# EAGLE design VlasceanuVladProiect2026 (EAGLE 9.7.0)
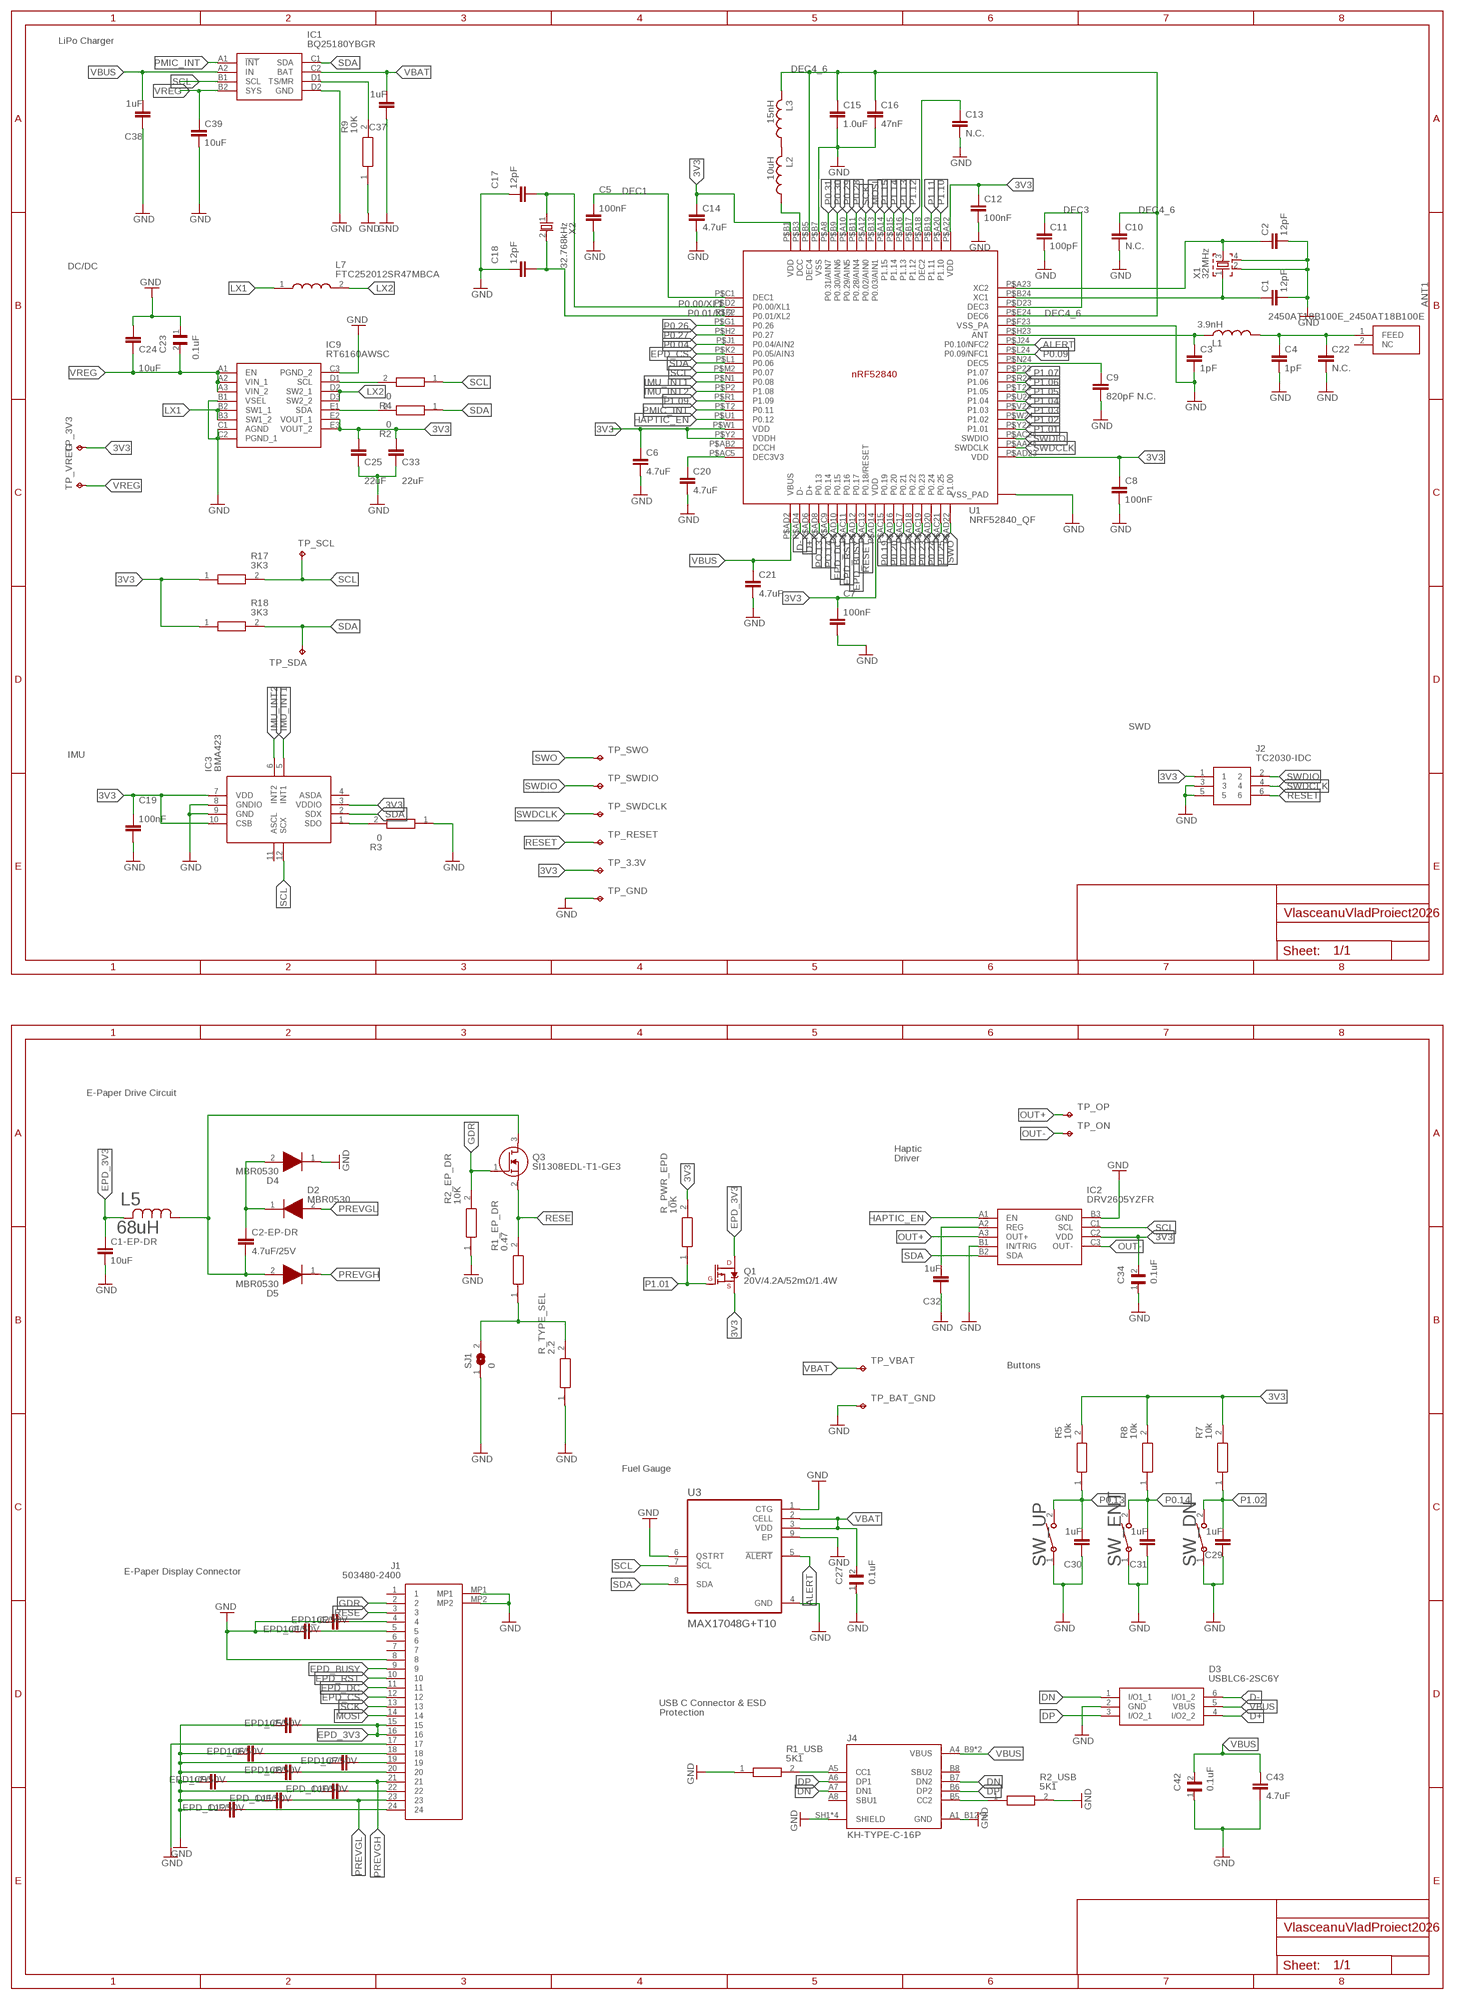
[diagram p0: schematic, sheet 1]

## Parts
ANT1  2450AT18B100E_2450AT18B100E  [2450AT18B100E_ANTC3216X140N]
C1  12pF  NORDIC_NRF_3_CAPACITOR_0201_L  [NORDIC_NRF_3_RESC0201_L]
C1-EP-DR  10uF  PERFECT_0402_CAP_0402  [PERFECT_0402_0402]
C2  12pF  NORDIC_NRF_3_CAPACITOR_0201_L  [NORDIC_NRF_3_RESC0201_L]
C2-EP-DR  4.7uF/25V  PERFECT_0402_CAP_0402  [PERFECT_0402_0402]
C3  1pF  NORDIC_NRF_3_CAPACITOR_0201_L  [NORDIC_NRF_3_RESC0201_L]
C4  1pF  NORDIC_NRF_3_CAPACITOR_0201_L  [NORDIC_NRF_3_RESC0201_L]
C5  100nF  NORDIC_NRF_3_CAPACITOR_0201_L  [NORDIC_NRF_3_RESC0201_L]
C6  4.7uF  PERFECT_0402_CAP_0402  [PERFECT_0402_0402]
C7  100nF  NORDIC_NRF_3_CAPACITOR_0201_L  [NORDIC_NRF_3_RESC0201_L]
C8  100nF  NORDIC_NRF_3_CAPACITOR_0201_L  [NORDIC_NRF_3_RESC0201_L]
C9  820pF N.C.  NORDIC_NRF_3_CAPACITOR_0201_L  [NORDIC_NRF_3_RESC0201_L]
C10  N.C.  NORDIC_NRF_3_CAPACITOR_0201_L  [NORDIC_NRF_3_RESC0201_L]
C11  100pF  NORDIC_NRF_3_CAPACITOR_0201_L  [NORDIC_NRF_3_RESC0201_L]
C12  100nF  NORDIC_NRF_3_CAPACITOR_0201_L  [NORDIC_NRF_3_RESC0201_L]
C13  N.C.  NORDIC_NRF_3_CAPACITOR_0201_L  [NORDIC_NRF_3_RESC0201_L]
C14  4.7uF  PERFECT_0402_CAP_0402  [PERFECT_0402_0402]
C15  1.0uF  PERFECT_0402_CAP_0402  [PERFECT_0402_0402]
C16  47nF  NORDIC_NRF_3_CAPACITOR_0201_L  [NORDIC_NRF_3_RESC0201_L]
C17  12pF  NORDIC_NRF_3_CAPACITOR_0201_L  [NORDIC_NRF_3_RESC0201_L]
C18  12pF  NORDIC_NRF_3_CAPACITOR_0201_L  [NORDIC_NRF_3_RESC0201_L]
C19  100nF  NORDIC_NRF_3_CAPACITOR_0201_L  [NORDIC_NRF_3_RESC0201_L]
C20  4.7uF  PERFECT_0402_CAP_0402  [PERFECT_0402_0402]
C21  4.7uF  PERFECT_0402_CAP_0402  [PERFECT_0402_0402]
C22  N.C.  NORDIC_NRF_3_CAPACITOR_0201_L  [NORDIC_NRF_3_RESC0201_L]
C23  0.1uF  GRM011R60J152KE01L_1_GRM011R60J152KE01L  [GRM011R60J152KE01L_1_0201]
C24  10uF  PERFECT_0402_CAP_0402  [PERFECT_0402_0402]
C25  22uF  PERFECT_0402_CAP_0402  [PERFECT_0402_0402]
C27  0.1uF  GRM011R60J152KE01L_2_GRM011R60J152KE01L  [GRM011R60J152KE01L_2_CAPC0201X13N]
C29  1uF  NORDIC_NRF_3_CAPACITOR_0402_L  [NORDIC_NRF_3_RESC0402_L]
C30  1uF  NORDIC_NRF_3_CAPACITOR_0402_L  [NORDIC_NRF_3_RESC0402_L]
C31  1uF  NORDIC_NRF_3_CAPACITOR_0402_L  [NORDIC_NRF_3_RESC0402_L]
C32  1uF  NORDIC_NRF_3_CAPACITOR_0402_L  [NORDIC_NRF_3_RESC0402_L]
C33  22uF  PERFECT_0402_CAP_0402  [PERFECT_0402_0402]
C34  0.1uF  GRM011R60J152KE01L_2_GRM011R60J152KE01L  [GRM011R60J152KE01L_2_CAPC0201X13N]
C37  1uF  NORDIC_NRF_3_CAPACITOR_0402_L  [NORDIC_NRF_3_RESC0402_L]
C38  1uF  NORDIC_NRF_3_CAPACITOR_0402_L  [NORDIC_NRF_3_RESC0402_L]
C39  10uF  NORDIC_NRF_3_CAPACITOR_0402_L  [NORDIC_NRF_3_RESC0402_L]
C42  0.1uF  GRM011R60J152KE01L_2_GRM011R60J152KE01L  [GRM011R60J152KE01L_2_CAPC0201X13N]
C43  4.7uF  PERFECT_0402_CAP_0402  [PERFECT_0402_0402]
D2  MBR0530  ESP32_C6_LIBRARY_5_MBR0530  [ESP32_C6_LIBRARY_5_SOD3716X135N]
D3  USBLC6-2SC6Y  ESP32_C6_LIBRARY_3_USBLC6-2SC6Y  [ESP32_C6_LIBRARY_3_SOT95P280X145-6N]
D4  MBR0530  ESP32_C6_LIBRARY_5_MBR0530  [ESP32_C6_LIBRARY_5_SOD3716X135N]
D5  MBR0530  ESP32_C6_LIBRARY_5_MBR0530  [ESP32_C6_LIBRARY_5_SOD3716X135N]
EPD_C1  1uF/50V  PERFECT_0402_CAP_0402  [PERFECT_0402_0402]
EPD_C2  1uF/50V  PERFECT_0402_CAP_0402  [PERFECT_0402_0402]
EPD_C5  1uF/50V  PERFECT_0402_CAP_0402  [PERFECT_0402_0402]
EPD_C6  1uF/50V  PERFECT_0402_CAP_0402  [PERFECT_0402_0402]
EPD_C7  1uF/50V  PERFECT_0402_CAP_0402  [PERFECT_0402_0402]
EPD_C8  1uF/50V  PERFECT_0402_CAP_0402  [PERFECT_0402_0402]
EPD_C9  1uF/50V  PERFECT_0402_CAP_0402  [PERFECT_0402_0402]
EPD_C10  1uF/50V  PERFECT_0402_CAP_0402  [PERFECT_0402_0402]
EPD_C11  1uF/50V  PERFECT_0402_CAP_0402  [PERFECT_0402_0402]
EPD_C12  1uF/50V  PERFECT_0402_CAP_0402  [PERFECT_0402_0402]
IC1  BQ25180YBGR  BQ25180YBGR_BQ25180YBGR  [BQ25180YBGR_BGA8C40P2X4_100X155X50]
IC2  DRV2605YZFR  DRV2605YZFR_DRV2605YZFR  [DRV2605YZFR_BGA9C50P3X3_144X144X62]
IC3  BMA423  BMA423_BMA423  [BMA423_BMA423]
IC9  RT6160AWSC  RT6160AWSC_RT6160AWSC  [RT6160AWSC_BGA15C40P3X5_140X230X60]
J1  503480-2400  503480-2400_503480-2400  [503480-2400_5034802400]
J2  TC2030-IDC  TC2030-IDC_TC2030-IDC  [TC2030-IDC_TC2030IDC]
J4  KH-TYPE-C-16P  KH-TYPE-C-16P_KH-TYPE-C-16P  [KH-TYPE-C-16P_KINGHELM_KH-TYPE-C-16P]
L1  3.9nH  NORDIC_NRF_2_INDUCTOR_0402_L  [NORDIC_NRF_2_RESC0402_L]
L2  10uH  NORDIC_NRF_2_INDUCTOR_0402_L  [NORDIC_NRF_2_RESC0402_L]
L3  15nH  NORDIC_NRF_2_INDUCTOR_0402_L  [NORDIC_NRF_2_RESC0402_L]
L5  68uH  ESP32_C6_LIBRARY_2_744043680IND_4828-WE-TPC_WRE  [ESP32_C6_LIBRARY_2_IND_4828-WE-TPC_WRE]
L7  FTC252012SR47MBCA  MLP2016SR47MT0S1_FTC252012SR47MBCA  [MLP2016SR47MT0S1_INDC2016X100N]
Q1  20V/4.2A/52mΩ/1.4W  ESP32_C6_LIBRARY_4_ESP32_WROVER_SPARKFUN-DISCRETESEMI_MOSFET_PCH-DMG2305UX-7  [ESP32_C6_LIBRARY_4_ESP32_C6_LIBRARY_4_ESP32_C6_LIBRARY_4_ESP32_C6_LIBRARY_4_ESP32_WROVER_SPARKFUN-DISCRETESEMI_SOT23-3]
Q3  SI1308EDL-T1-GE3  ESP32_C6_LIBRARY_6_SI1308EDL-T1-GE3  [ESP32_C6_LIBRARY_6_SOT65P210X110-3N]
R1_EP_DR  0.47  ERA-1AEB3401C_CPF0201D7K68C1  [ERA-1AEB3401C_0201]
R1_USB  5K1  CPF0201D7K68C1_CPF0201D7K68C1  [CPF0201D7K68C1_0201]
R2  0  ERA-1AEB3401C_CPF0201D7K68C1  [ERA-1AEB3401C_0201]
R2_EP_DR  10K  ERA-1AEB3401C_CPF0201D7K68C1  [ERA-1AEB3401C_0201]
R2_USB  5K1  CPF0201D7K68C1_CPF0201D7K68C1  [CPF0201D7K68C1_0201]
R3  0  CPF0201D7K68C1_CPF0201D7K68C1  [CPF0201D7K68C1_0201]
R4  0  ERA-1AEB3401C_CPF0201D7K68C1  [ERA-1AEB3401C_0201]
R5  10k  CPF0201D7K68C1_CPF0201D7K68C1  [CPF0201D7K68C1_0201]
R7  10k  CPF0201D7K68C1_CPF0201D7K68C1  [CPF0201D7K68C1_0201]
R8  10k  CPF0201D7K68C1_CPF0201D7K68C1  [CPF0201D7K68C1_0201]
R9  10K  ERA-1AEB3401C_CPF0201D7K68C1  [ERA-1AEB3401C_0201]
R17  3K3  ERA-1AEB3401C_CPF0201D7K68C1  [ERA-1AEB3401C_0201]
R18  3K3  ERA-1AEB3401C_CPF0201D7K68C1  [ERA-1AEB3401C_0201]
R_PWR_EPD  10K  CPF0201D7K68C1_CPF0201D7K68C1  [CPF0201D7K68C1_0201]
R_TYPE_SEL  2.2  ERA-1AEB3401C_CPF0201D7K68C1  [ERA-1AEB3401C_0201]
SJ1  0  ESP32_C6_LIBRARY_7_JUMPER_SJ  [ESP32_C6_LIBRARY_7_JUMPER_SJ]
SW_DN  2025-10-22_07-23-44_LIBRARY_EVP-AKE31ASW_EVP-AKE31A_PAN  [2025-10-22_07-23-44_LIBRARY_SW_EVP-AKE31A_PAN]
SW_ENT  2025-10-22_07-23-44_LIBRARY_EVP-AKE31ASW_EVP-AKE31A_PAN  [2025-10-22_07-23-44_LIBRARY_SW_EVP-AKE31A_PAN]
SW_UP  2025-10-22_07-23-44_LIBRARY_EVP-AKE31ASW_EVP-AKE31A_PAN  [2025-10-22_07-23-44_LIBRARY_SW_EVP-AKE31A_PAN]
TP_3.3V  HECTOR_WATCH_1_TPTP20R  [HECTOR_WATCH_1_TP20R]
TP_3V3  HECTOR_WATCH_1_TPTP20R  [HECTOR_WATCH_1_TP20R]
TP_BAT_GND  HECTOR_WATCH_1_TPTP20R  [HECTOR_WATCH_1_TP20R]
TP_GND  HECTOR_WATCH_1_TPTP20R  [HECTOR_WATCH_1_TP20R]
TP_ON  HECTOR_WATCH_1_TPTP20R  [HECTOR_WATCH_1_TP20R]
TP_OP  HECTOR_WATCH_1_TPTP20R  [HECTOR_WATCH_1_TP20R]
TP_RESET  HECTOR_WATCH_1_TPTP20R  [HECTOR_WATCH_1_TP20R]
TP_SCL  HECTOR_WATCH_1_TPTP20R  [HECTOR_WATCH_1_TP20R]
TP_SDA  HECTOR_WATCH_1_TPTP20R  [HECTOR_WATCH_1_TP20R]
TP_SWDCLK  HECTOR_WATCH_1_TPTP20R  [HECTOR_WATCH_1_TP20R]
TP_SWDIO  HECTOR_WATCH_1_TPTP20R  [HECTOR_WATCH_1_TP20R]
TP_SWO  HECTOR_WATCH_1_TPTP20R  [HECTOR_WATCH_1_TP20R]
TP_VBAT  HECTOR_WATCH_1_TPTP20R  [HECTOR_WATCH_1_TP20R]
TP_VREG  HECTOR_WATCH_1_TPTP20R  [HECTOR_WATCH_1_TP20R]
U1  NRF52840_QF  NORDIC_NRF_4_NRF52840_QF  [NORDIC_NRF_4_AQFN50P700X700X85_HS-74N]
U3  MAX17048G+T10  ESP32_C6_LIBRARY_MAX17048G+T10  [ESP32_C6_LIBRARY_SON50P200X200X80-9N]
X1  32MHz  NORDIC_NRF_XTAL_32MHZ  [NORDIC_NRF_BT-XTAL_2016_N]
X2  32.768kHz  NORDIC_NRF_1_XTAL_32KHZ  [NORDIC_NRF_1_XTAL_3215_N]

## Nets
3V3: C6.1 C7.1 C8.1 C12.1 C14.1 C19.1 C25.1 C33.1 C34.2 IC2.C2(VDD) IC3.3(VDDIO) IC3.7(VDD) IC3.10(CSB) IC9.E2(VOUT_1) IC9.E3(VOUT_2) J2.1 Q1.2(S) R5.2 R7.2 R8.2 R17.1 R18.1 R_PWR_EPD.2 TP_3.3V.TP TP_3V3.TP U1.P$A22(VDD) U1.P$AD14(VDD) U1.P$AD23(VDD) U1.P$B1(VDD) U1.P$W1(VDD) U1.P$Y2(VDDH)
ALERT: U1.P$J24(P0.10/NFC2) U3.5(!ALERT)
D+: D3.4(I/O2_2) U1.P$AD6(D+)
D-: D3.6(I/O1_2) U1.P$AD4(D-)
DEC1: C5.1 U1.P$C1(DEC1)
DEC3: C11.1 U1.P$D23(DEC3)
DEC4_6: C10.1 C15.1 C16.1 L3.2 U1.P$B5(DEC4) U1.P$E24(DEC6)
DN: D3.1(I/O1_1) J4.A7(DN1) J4.B7(DN2)
DP: D3.3(I/O2_1) J4.A6(DP1) J4.B6(DP2)
EPD_3V3: C1-EP-DR.1 EPD_C5.2 J1.15 J1.16 L5.2 Q1.3(D)
EPD_BUSY: J1.9 U1.P$AD12(P0.17)
EPD_CS: J1.12 U1.P$K2(P0.05/AIN3)
EPD_DC: J1.11 U1.P$AD10(P0.15)
EPD_RST: J1.10 U1.P$AC11(P0.16)
GDR: J1.2 Q3.1(G) R2_EP_DR.2
GND: C1-EP-DR.2 C1.2 C2.2 C3.2 C4.2 C5.2 C6.2 C7.2 C8.2 C9.2 C10.2 C11.2 C12.2 C13.2 C14.2 C15.2 C16.2 C17.1 C18.1 C19.2 C20.2 C21.2 C22.2 C23.1 C24.1 C25.2 C27.1 C29.1 C30.1 C31.1 C32.1 C33.2 C34.1 C37.1 C38.1 C39.2 C42.1 C43.2 D3.2(GND) D4.1(K) EPD_C1.1 EPD_C2.1 EPD_C5.1 EPD_C6.1 EPD_C7.1 EPD_C8.1 EPD_C9.1 EPD_C10.1 EPD_C11.1 EPD_C12.1 IC1.D2(GND) IC2.B1(IN/TRIG) IC2.B3(GND) IC3.8(GNDIO) IC3.9(GND) IC9.B1(VSEL) IC9.C1(AGND) IC9.C2(PGND_1) IC9.C3(PGND_2) J1.8 J1.17 J1.MP1 J1.MP2 J2.3 J2.5 J4.A1_B12(GND) J4.A12_B1(GND) J4.SH1(SHIELD) J4.SH2(SHIELD) J4.SH3(SHIELD) J4.SH4(SHIELD) R1_USB.1 R2_EP_DR.1 R2_USB.2 R3.1 R9.1 R_TYPE_SEL.1 SJ1.1 SW_DN.1 SW_ENT.1 SW_UP.1 TP_BAT_GND.TP TP_GND.TP U1.P$74(VSS_PAD) U1.P$75(VSS_PAD) U1.P$76(VSS_PAD) U1.P$77(VSS_PAD) U1.P$78(VSS_PAD) U1.P$79(VSS_PAD) U1.P$80(VSS_PAD) U1.P$81(VSS_PAD) U1.P$82(VSS_PAD) U1.P$83(VSS_PAD) U1.P$84(VSS_PAD) U1.P$85(VSS_PAD) U1.P$86(VSS_PAD) U1.P$87(VSS_PAD) U1.P$88(VSS_PAD) U1.P$89(VSS_PAD) U1.P$90(VSS_PAD) U1.P$B7(VSS) U1.P$F23(VSS_PA) U3.1(CTG) U3.4(GND) U3.6(QSTRT) U3.9(EP) X1.2 X1.4
HAPTIC_EN: IC2.A1(EN) U1.P$U1(P0.12)
IMU_INT1: IC3.5(INT1) U1.P$N1(P0.08)
IMU_INT2: IC3.6(INT2) U1.P$P2(P1.08)
LX1: IC9.B2(SW1_1) IC9.B3(SW1_2) L7.1
LX2: IC9.D2(SW2_1) IC9.D3(SW2_2) L7.2
MOSI: J1.14 U1.P$B13(P0.03/AIN1)
N$1: ANT1.1(FEED) C4.1 C22.1 L1.2
N$2: IC9.D1(SCL) R4.2
N$3: IC1.D1(TS/MR) R9.2
N$4: C2.1 U1.P$A23(XC2) X1.3
N$5: IC9.E1(SDA) R2.2
N$6: J4.A5(CC1) R1_USB.2
N$7: L2.2 L3.1
N$8: IC3.1(SDO) R3.2
N$9: C1.1 U1.P$B24(XC1) X1.1
N$10: C3.1 L1.1 U1.P$H23(ANT)
N$11: C32.2 IC2.A2(REG)
N$13: C2-EP-DR.1 D2.1(K) D4.2(A)
N$14: C9.1 U1.P$N24(DEC5)
N$15: R1_EP_DR.1 R_TYPE_SEL.2 SJ1.2
N$16: C2-EP-DR.2 D5.2(A) L5.1 Q3.3(D)
N$17: EPD_C2.2 J1.4
N$18: EPD_C1.2 J1.5
N$20: C20.1 U1.P$AC5(DEC3V3)
N$22: L2.1 U1.P$B3(DCC)
N$26: J4.B5(CC2) R2_USB.1
N$30: EPD_C6.2 J1.18
N$31: EPD_C7.2 J1.19
N$32: EPD_C8.2 J1.20
N$34: EPD_C10.2 J1.22
N$35: C13.1 U1.P$A18(DEC2)
N$37: EPD_C12.2 J1.24
OUT+: IC2.A3(OUT+) TP_OP.TP
OUT-: IC2.C3(OUT-) TP_ON.TP
P0.00/XL1: C17.2 U1.P$D2(P0.00/XL1) X2.1
P0.01/XL2: C18.2 U1.P$F2(P0.01/XL2) X2.2
P0.04: U1.P$J1(P0.04/AIN2)
P0.09: U1.P$L24(P0.09/NFC1)
P0.13: C30.2 R5.1 SW_UP.2
P0.14: C31.2 R8.1 SW_ENT.2
P0.19: U1.P$AC15(P0.19)
P0.20: U1.P$AD16(P0.20)
P0.21: U1.P$AC17(P0.21)
P0.22: U1.P$AD18(P0.22)
P0.23: U1.P$AC19(P0.23)
P0.24: U1.P$AD20(P0.24)
P0.25: U1.P$AC21(P0.25)
P0.26: U1.P$G1(P0.26)
P0.27: U1.P$H2(P0.27)
P0.28: U1.P$B11(P0.28/AIN4)
P0.29: U1.P$A10(P0.29/AIN5)
P0.30: U1.P$B9(P0.30/AIN6)
P0.31: U1.P$A8(P0.31/AIN7)
P1.01: Q1.1(G) R_PWR_EPD.1 U1.P$Y23(P1.01)
P1.02: C29.2 R7.1 SW_DN.2 U1.P$W24(P1.02)
P1.03: U1.P$V23(P1.03)
P1.04: U1.P$U24(P1.04)
P1.05: U1.P$T23(P1.05)
P1.06: U1.P$R24(P1.06)
P1.07: U1.P$P23(P1.07)
P1.09: U1.P$R1(P1.09)
P1.10: U1.P$A20(P1.10)
P1.11: U1.P$B19(P1.11)
P1.12: U1.P$B17(P1.12)
P1.13: U1.P$A16(P1.13)
P1.14: U1.P$B15(P1.14)
P1.15: U1.P$A14(P1.15)
PMIC_INT: IC1.A1(!INT) U1.P$T2(P0.11)
PO.13: U1.P$AD8(P0.13)
PO.14: U1.P$AC9(P0.14)
PREVGH: D5.1(K) EPD_C9.2 J1.21
PREVGL: D2.2(A) EPD_C11.2 J1.23
RESE: J1.3 Q3.2(S) R1_EP_DR.2
RESET: J2.6 TP_RESET.TP U1.P$AC13(P0.18/RESET)
SCK: J1.13 U1.P$A12(P0.02/AIN0)
SCL: IC1.B1(SCL) IC2.C1(SCL) IC3.12(SCX) R4.1 R17.2 TP_SCL.TP U1.P$M2(P0.07) U3.7(SCL)
SDA: IC1.C1(SDA) IC2.B2(SDA) IC3.2(SDX) R2.1 R18.2 TP_SDA.TP U1.P$L1(P0.06) U3.8(SDA)
SWDCLK: J2.4 TP_SWDCLK.TP U1.P$AA24(SWDCLK)
SWDIO: J2.2 TP_SWDIO.TP U1.P$AC24(SWDIO)
SWO: TP_SWO.TP U1.P$AD22(P1.00)
VBAT: C27.2 C37.2 IC1.C2(BAT) TP_VBAT.TP U3.2(CELL) U3.3(VDD)
VBUS: C21.1 C38.2 C42.2 C43.1 D3.5(VBUS) IC1.A2(IN) J4.A4_B9(VBUS) J4.A9_B4(VBUS) U1.P$AD2(VBUS)
VREG: C23.2 C24.2 C39.1 IC1.B2(SYS) IC9.A1(EN) IC9.A2(VIN_1) IC9.A3(VIN_2) TP_VREG.TP
Unconnected: ANT1.2(NC) IC3.4(ASDA) IC3.11(ASCL) J1.1 J1.6 J1.7 J4.A8(SBU1) J4.B8(SBU2) U1.P$AB2(DCCH)

## Notes on the sheet
- LiPo Charger
- DC/DC
- SWD
- IMU
- E-Paper Drive Circuit
- Haptic
  Driver
- Buttons
- Fuel Gauge
- E-Paper Display Connector
- USB C Connector & ESD
  Protection

## Library data of the parts
ANT1 = inktime:2450AT18B100E_2450AT18B100E: Antennas 2.45GHz ANTENNA Source: Datasheet <https://www.johansontechnology.com/datasheets/2450AT18B100/2450AT18B100.pdf>
C1-C5 C7-C13 C16-C19 C22 C29-C32 C37-C39 = inktime:NORDIC_NRF_3_CAPACITOR: Generic chip capacitor
C1-EP-DR C2-EP-DR C6 C14 C15 C20 C21 C24 C25 C33 C43 EPD_C1 EPD_C2 EPD_C5-EPD_C12 = inktime:PERFECT_0402_CAP_0402: 0402 (1005 Metric) Nick Garner - TeleSense
C23 = inktime:GRM011R60J152KE01L_1_GRM011R60J152KE01L: Check availability <https://pricing.snapeda.com/parts/GRM011R60J152KE01L/Murata/view-part?ref=eda>
C27 C34 C42 = inktime:GRM011R60J152KE01L_2_GRM011R60J152KE01L: Check availability <https://pricing.snapeda.com/parts/GRM011R60J152KE01L/Murata/view-part?ref=eda>
D2 D4 D5 = inktime:ESP32_C6_LIBRARY_5_MBR0530: ON SEMICONDUCTOR - MBR0530 - DIODE, SCHOTTKY, 0.5A, 30V, SOD-123 Source: Datasheet <http://www.onsemi.com/pub/Collateral/MBR0530T1-D.PDF> Check availability <https://pricing.snapeda.com/parts/MBR0530/ON%20Semiconductor/view-part?ref=eda>
D3 = inktime:ESP32_C6_LIBRARY_3_USBLC6-2SC6Y: Low Cap. ESD Protection Auto SOT-23-6 STMicroelectronics USBLC6-2SC6Y, Dual Uni-Directional TVS Diode Array, 6-Pin SOT-23 Source: Datasheet <https://componentsearchengine.com/Datasheets/1/USBLC6-2SC6Y.pdf> Check availability <https://pricing.snapeda.com/parts/USBLC6-2SC6Y/STMicroelectronics/view-part?ref=eda>
IC1 = inktime:BQ25180YBGR_BQ25180YBGR: Charger IC Lithium Ion/Polymer, Lithium Iron Phosphate 8-DSBGA (1.6x1.1) Source: Datasheet <https://www.ti.com/lit/ds/symlink/bq25180.pdf?ts=1650264094470&ref_url=https%3A%2F%2Fwww.ti.com%2Fproduct%2FBQ25180>
IC2 = inktime:DRV2605YZFR_DRV2605YZFR: Haptic Driver for ERM/LRA with Built-In Library and Smart Loop Architecture Source: Datasheet <http://www.ti.com/lit/gpn/drv2605>
IC3 = inktime:BMA423_BMA423: Accelerometers Triaxial low-g 12bit Acceleration Sensor Source: Datasheet <https://www.mouser.com/datasheet/2/783/BST-BMA423-DS000-1509600.pdf>
IC9 = inktime:RT6160AWSC_RT6160AWSC: Buck-Boost Regulator Positive Output Step-Up/Step-Down I2C DC-DC Controller IC 15-WL-CSP (BSC) (1.4x2.3) Source: Datasheet <https://www.richtek.com/SaveDownload.aspx?specid=RT6160A>
J1 = inktime:503480-2400_503480-2400: FFC & FPC Connectors 0.5mm FPC RA SMT Dual Contact 24Ckt Source: Datasheet <https://componentsearchengine.com/Datasheets/1/503480-2400.pdf>
J2 = inktime:TC2030-IDC_TC2030-IDC: CABLE ADAPTER 6 POS Source: Datasheet <https://datasheet.datasheetarchive.com/originals/distributors/Datasheets_SAMA/62bc384e093448baaaa63dbd0b9d8707.pdf>
J4 = inktime:KH-TYPE-C-16P_KH-TYPE-C-16P: Check availability <https://pricing.snapeda.com/parts/KH-TYPE-C-16P/kinghelm/view-part?ref=eda>
L1-L3 = inktime:NORDIC_NRF_2_INDUCTOR: Generic chip inductor
L5 = inktime:ESP32_C6_LIBRARY_2_744043680
L7 = inktime:MLP2016SR47MT0S1_FTC252012SR47MBCA: SMD / SMT Inductors (Coils), L=0.47?H, L x W x T : Source: Datasheet <https://product.tdk.com/system/files/dam/doc/product/inductor/inductor/smd/catalog/inductor_commercial_power_mlp2016_en.pdf>
Q1 = inktime:ESP32_C6_LIBRARY_4_ESP32_WROVER_SPARKFUN-DISCRETESEMI_MOSFET_PCH: P-channel MOSFETs Voltage controlled devices that allow control of high current outputs. SparkFun Products: SparkFun ESP32 Thing <https://www.sparkfun.com/products/13907> SparkFun ESP8266 Thing <https://www.sparkfun.com/products/13231> SparkFun Pi Servo HAT V2 <https://www.sparkfun.com/products/15316> DMG2305UX-7 (20V/4.2A/SOT23-3)
Q3 = inktime:ESP32_C6_LIBRARY_6_SI1308EDL-T1-GE3: MOSFET N-Ch 30V 1.5A TrenchFET SC70 Vishay Si1308EDL-T1-GE3 N-channel MOSFET Transistor, 1.5 A, 30 V, 3-Pin SC-70 Source: Datasheet <https://componentsearchengine.com/Datasheets/1/SI1308EDL-T1-GE3.pdf> Check availability <https://pricing.snapeda.com/parts/SI1308EDL-T1-GE3/Vishay%20Siliconix/view-part?ref=eda>
R1_EP_DR R2 R2_EP_DR R4 R9 R17 R18 R_TYPE_SEL = inktime:ERA-1AEB3401C_CPF0201D7K68C1: 7.68k 0201 Thin Film Surface Mount Fixed Resistor +/-0.5% 0.031W CPF0201D7K68C1 Source: Datasheet <http://www.te.com/commerce/DocumentDelivery/DDEController?Action=showdoc&DocId=Data Sheet1773200-1ApdfEnglishENG_DS_1773200-1_A.pdf4-2176215-6>
R1_USB R2_USB R3 R5 R7 R8 R_PWR_EPD = inktime:CPF0201D7K68C1_CPF0201D7K68C1: 7.68k 0201 Thin Film Surface Mount Fixed Resistor +/-0.5% 0.031W CPF0201D7K68C1 Source: Datasheet <http://www.te.com/commerce/DocumentDelivery/DDEController?Action=showdoc&DocId=Data Sheet1773200-1ApdfEnglishENG_DS_1773200-1_A.pdf4-2176215-6>
SJ1 = inktime:ESP32_C6_LIBRARY_7_JUMPER_SJ: SMD solder JUMPER
SW_DN SW_ENT SW_UP = inktime:2025-10-22_07-23-44_LIBRARY_EVP-AKE31A
TP_3.3V TP_3V3 TP_BAT_GND TP_GND TP_ON TP_OP TP_RESET TP_SCL TP_SDA TP_SWDCLK TP_SWDIO TP_SWO TP_VBAT TP_VREG = inktime:HECTOR_WATCH_1_TP: Test pad
U1 = inktime:NORDIC_NRF_4_NRF52840_QF: nRF52840 Features Advanced Single chip 2.4 GHz multi-protocol SoC 32-bit ARM Cortex-M4F Processor 1.7v to 5.5v operation 1MB flash + 256kB RAM Bluetooth 5 support for long range and high throughput 802.15.4 radio support On-chip NFC PPI –Programmable Peripheral Interconnect Automated power management system with automatic power management of each peripheral Configurable I/O mapping for analog and digital I/O 48 x GPIO 1 x QSPI 4 x Master/Slave SPI 2 x Two-wire interface (I²C) I²S interface 2 x UART 4 x PWM USB 2.0 controller ARM TrustZone CryptoCell-310 Cryptographic and security module AES 128-bit ECB/CCM/AAR hardware accelerator Digital microphone interface (PDM) Quadrature decoder 12-bit ADC Low power comparator On-chip 50Ω balun On-air compatible with nRF52, nRF51 and nRF24 Series Applications Advanced high performance wearables Wearables for secure payments Virtual Reality/Augmented Reality systems Smart Home sensor networks Smart city sensor networks High performance HID controllers Internet of Things (IoT) sensor networks Smart door locks Smart lighting networks Connected white goods
U3 = inktime:ESP32_C6_LIBRARY_MAX17048G+T10: Check availability <https://pricing.snapeda.com/parts/MAX17048G%2BT10/Analog%20Devices/view-part?ref=eda>
X1 = inktime:NORDIC_NRF_XTAL_32MHZ
X2 = inktime:NORDIC_NRF_1_XTAL_32KHZ

## Board
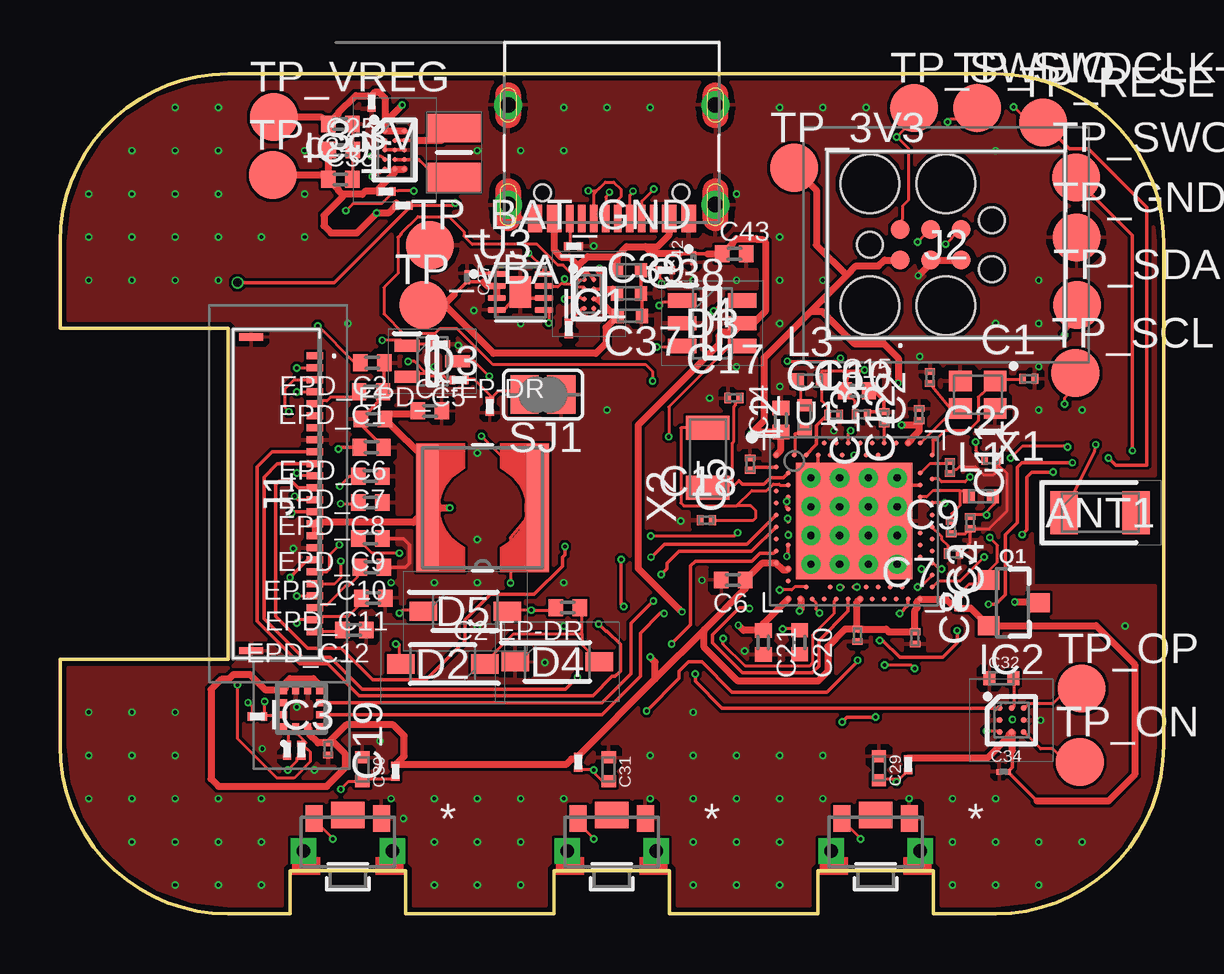
[diagram p1: board, top side]
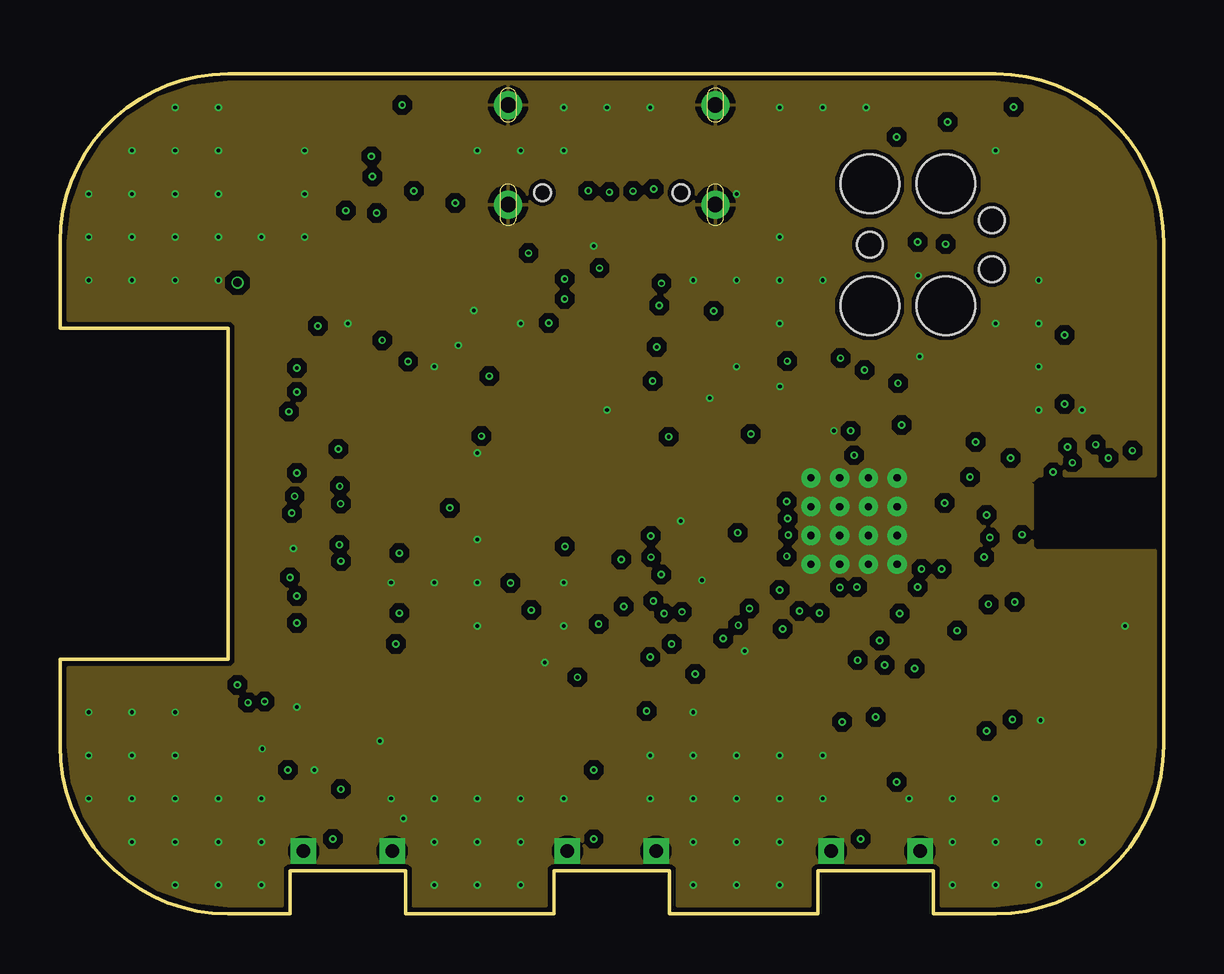
[diagram p2: board, inner layer Route2]
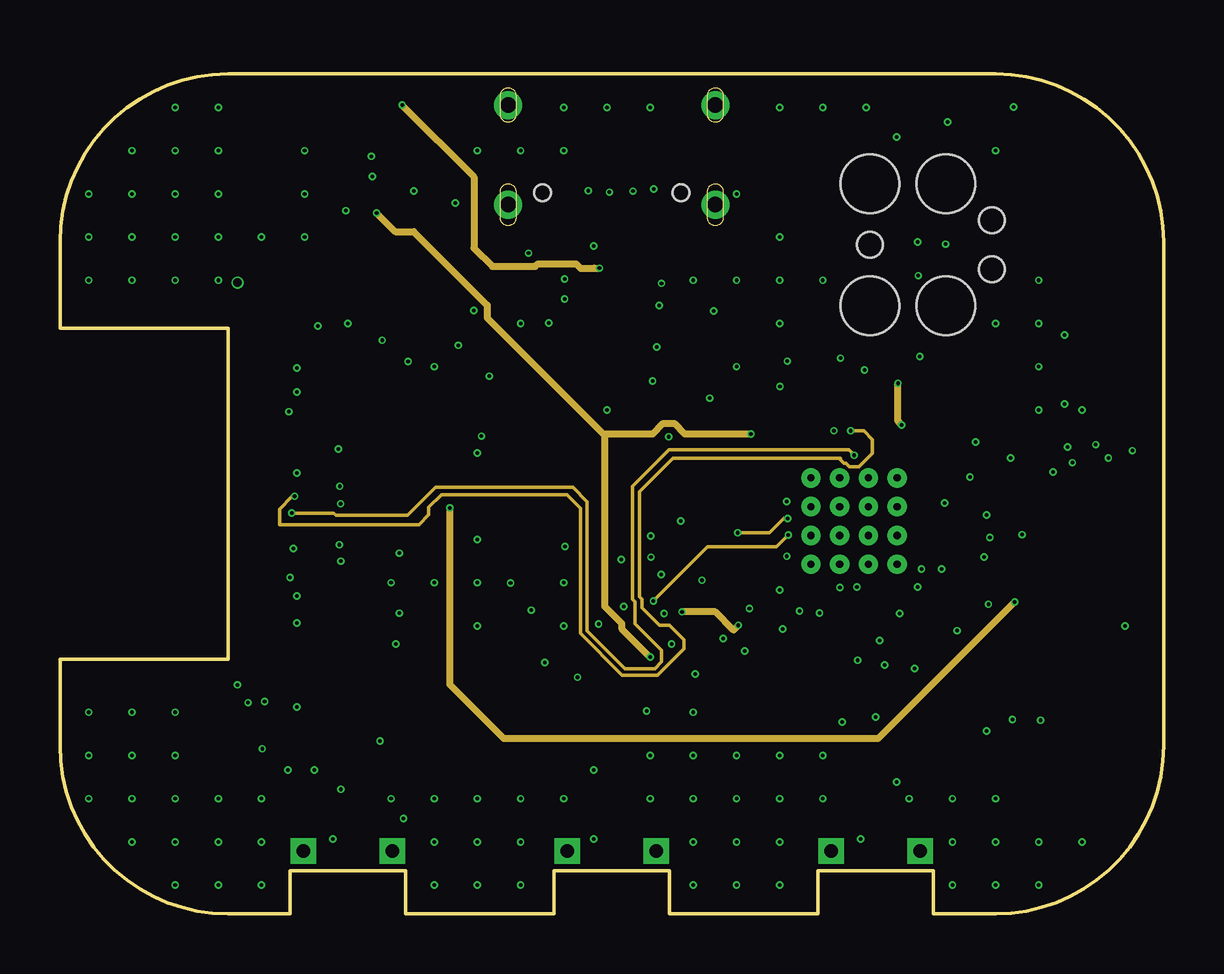
[diagram p3: board, inner layer Route63]
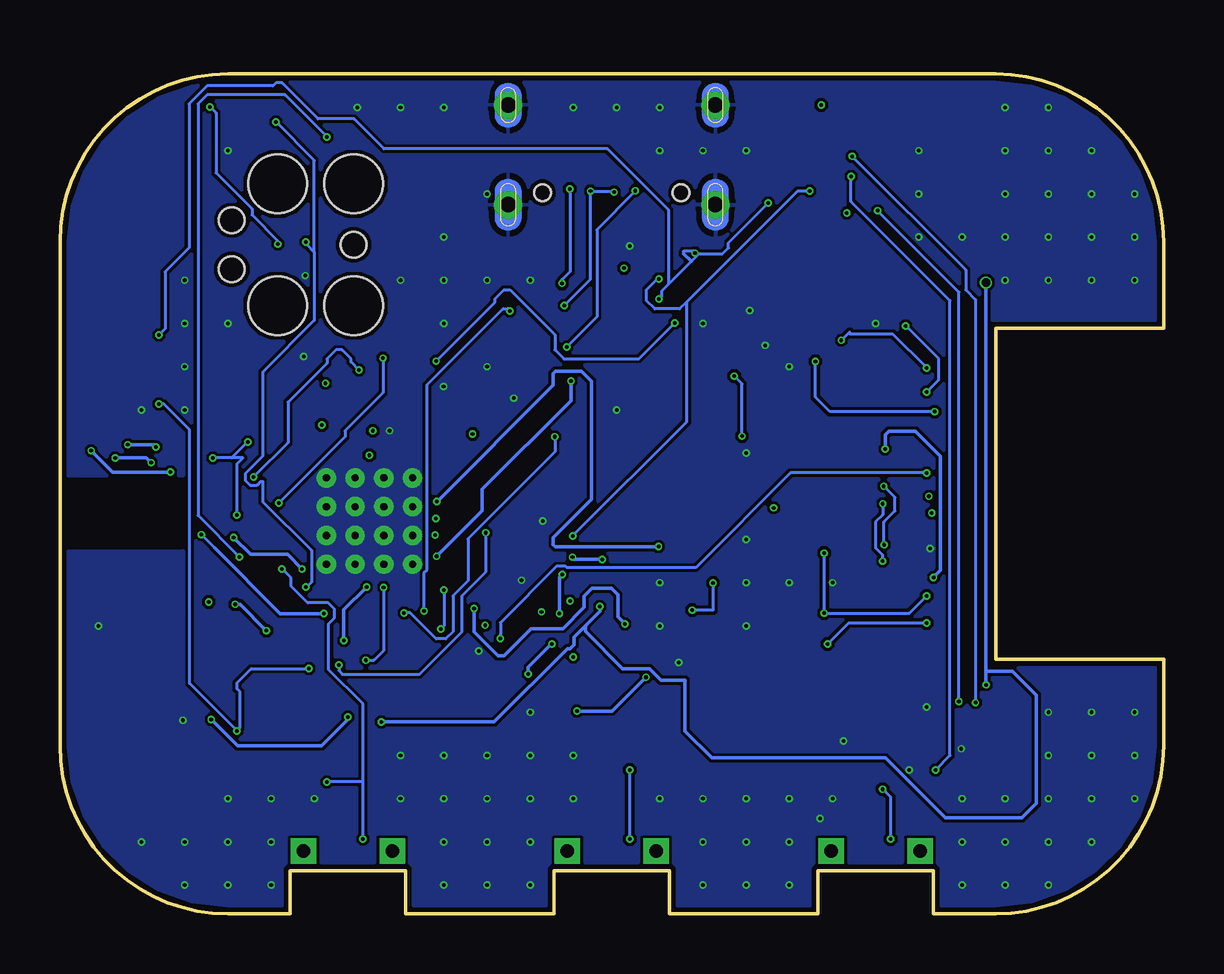
[diagram p4: board, bottom side, seen from below]

Size 46 x 35 mm. Coordinates in mm from the lower left corner, seen from the top.
Outline: 39,0 36.4,0 36.4,1.8 31.6,1.8 31.6,0 25.4,0 25.4,1.8 20.6,1.8 20.6,0 14.4,0 14.4,1.8 9.6,1.8 9.6,0 7,0 arc-90 0,7 0,10.6 7,10.6 7,24.4 0,24.4 0,28 arc-90 7,35 39,35 arc-90 46,28 46,7 arc-90 39,0
Copper layers (1+2*15+16): Top / Route2 / Route63 / Bottom
Stack-up 4 Layer Stack: Top SilkScreen Epoxy Ink / Top SolderMask SR:Green 0.0254mm Dk 4.3 / Top Surface Finish Lead-Free 0.02mm / Top CuFoil:007 0.035mm / Dielectric-1 Prepreg:001 0.064mm / Dielectric-2 Prepreg:001 0.064mm / Route2 CuFoil:007 0.035mm / Dielectric-3 Core:066 0.711mm / Route63 CuFoil:007 0.035mm / Dielectric-4 Prepreg:001 0.064mm / Dielectric-5 Prepreg:001 0.064mm / Bottom CuFoil:007 0.035mm / Bottom Surface Finish Lead-Free 0.02mm / Bottom SolderMask SR:Green 0.0254mm Dk 4.3 / Bottom SilkScreen Epoxy Ink
Design rules: minimum copper width 5mil, minimum drill size 0.15mm, copper clearance wire_polygon to wire_polygon 5mil, copper clearance wire_polygon to pad_smd 5mil, copper clearance wire_polygon to via 5mil, copper clearance pad_smd to pad_smd 5mil, copper clearance pad_smd to via 5mil, copper clearance via to via 5mil, copper clearance smd to pad (same net) 5mil, copper clearance smd to via (same net) 5mil, copper clearance smd to smd (same net) 5mil, dimension clearance 0.2mm, via restrict clearance 0mil, restrict clearance 0mil, drill distance 6mil, keepout clearance 0mil
RestrictTop: area 40.6,18.2 to 40.8,18.2; area 40.6,13.7 to 45.8,18.2

### Footprints (pad centres in the part's own frame; a part is rotated, then mirrored left to right if it is on the bottom)
2450AT18B100E_ANTC3216X140N = smd 1.15 x 1.8: 1 -1.5,0; 2 1.5,0
NORDIC_NRF_3_RESC0201_L = smd 0.28 x 0.43: 1 -0.255,0; 2 0.255,0
PERFECT_0402_0402 = smd 0.6 x 0.7: 1 -0.5,0; 2 0.5,0
GRM011R60J152KE01L_1_0201 = smd 0.35 x 0.25: 1 0,0.275; 2 0,-0.275
GRM011R60J152KE01L_2_CAPC0201X13N = smd 0.22 x 0.23: 1 -0.185,0; 2 0.185,0
NORDIC_NRF_3_RESC0402_L = smd 0.5 x 0.6: 1 -0.5,0; 2 0.5,0
ESP32_C6_LIBRARY_5_SOD3716X135N = smd 1.15 x 0.8: 1 -1.75,0; 2 1.75,0
ESP32_C6_LIBRARY_3_SOT95P280X145-6N = smd 1.2 x 0.6: 1 -1.25,0.95; 2 -1.25,0; 3 -1.25,-0.95; 4 1.25,-0.95; 5 1.25,0; 6 1.25,0.95
BQ25180YBGR_BGA8C40P2X4_100X155X50 = smd 0.2 x 0.2: A1 -0.2,0.6; A2 0.2,0.6; B1 -0.2,0.2; B2 0.2,0.2; C1 -0.2,-0.2; C2 0.2,-0.2; D1 -0.2,-0.6; D2 0.2,-0.6
DRV2605YZFR_BGA9C50P3X3_144X144X62 = smd 0.25 x 0.25: A1 -0.5,0.5; A2 0,0.5; A3 0.5,0.5; B1 -0.5,0; B2 0,0; B3 0.5,0; C1 -0.5,-0.5; C2 0,-0.5; C3 0.5,-0.5
BMA423_BMA423 = smd 0.3 x 0.35: 1 -0.75,-0.775; 2 -0.25,-0.775; 3 0.25,-0.775; 4 0.75,-0.775; 7 0.75,0.775; 8 0.25,0.775; 9 -0.25,0.775; 10 -0.75,0.775 | smd 0.35 x 0.3: 5 0.775,-0.25; 6 0.775,0.25; 11 -0.775,0.25; 12 -0.775,-0.25
RT6160AWSC_BGA15C40P3X5_140X230X60 = smd 0.216 x 0.216: A1 -0.4,0.8; A2 0,0.8; A3 0.4,0.8; B1 -0.4,0.4; B2 0,0.4; B3 0.4,0.4; C1 -0.4,0; C2 0,0; C3 0.4,0; D1 -0.4,-0.4; D2 0,-0.4; D3 0.4,-0.4; E1 -0.4,-0.8; E2 0,-0.8; E3 0.4,-0.8
503480-2400_5034802400 = smd 0.3 x 0.7: 1 -5.75,1.525; 2 -5.25,1.525; 3 -4.75,1.525; 4 -4.25,1.525; 5 -3.75,1.525; 6 -3.25,1.525; 7 -2.75,1.525; 8 -2.25,1.525; 9 -1.75,1.525; 10 -1.25,1.525; 11 -0.75,1.525; 12 -0.25,1.525; 13 0.25,1.525; 14 0.75,1.525; 15 1.25,1.525; 16 1.75,1.525; 17 2.25,1.525; 18 2.75,1.525; 19 3.25,1.525; 20 3.75,1.525; 21 4.25,1.525; 22 4.75,1.525; 23 5.25,1.525; 24 5.75,1.525 | smd 0.3 x 1: MP1 -6.54,-1.125; MP2 6.54,-1.125
TC2030-IDC_TC2030IDC = smd 0.783 x 0.783: 1 -0.953,-0.635; 2 -0.953,0.635; 3 0.317,-0.635; 4 0.317,0.635; 5 1.588,-0.635; 6 1.588,0.635 | hole 2.451: -2.223,-2.54; -2.223,2.54; 0.952,-2.54; 0.952,2.54 | hole 1.067: -2.223,0; 2.857,-1.016; 2.857,1.016
KH-TYPE-C-16P_KINGHELM_KH-TYPE-C-16P = smd 0.6 x 1.15: A1_B12 -3.2,4.725; A4_B9 -2.4,4.725; A9_B4 2.4,4.725; A12_B1 3.2,4.725 | smd 0.3 x 1.15: A5 -1.25,4.725; A6 -0.25,4.725; A7 0.25,4.725; A8 1.25,4.725; B5 1.75,4.725; B6 0.75,4.725; B7 -0.75,4.725; B8 -1.75,4.725 | drill 0.65 pad 1.05: SH1 -4.32,0; SH2 4.32,0; SH3 -4.32,4.15; SH4 4.32,4.15 | hole 0.7: -2.89,3.65; 2.89,3.65
NORDIC_NRF_2_RESC0402_L = smd 0.5 x 0.6: 1 -0.5,0; 2 0.5,0
ESP32_C6_LIBRARY_2_IND_4828-WE-TPC_WRE = smd 0.9 x 5.3: 1 -2.286,0; 2 2.286,0
MLP2016SR47MT0S1_INDC2016X100N = smd 1.2 x 2.2: 1 -1.028,0; 2 1.028,0
ESP32_C6_LIBRARY_4_ESP32_C6_LIBRARY_4_ESP32_C6_LIBRARY_4_ESP32_C6_LIBRARY_4_ESP32_WROVER_SPARKFUN-DISCRETESEMI_SOT23-3 = smd 0.8 x 0.9: 1 -0.95,-1; 2 0.95,-1; 3 0,1.1
ESP32_C6_LIBRARY_6_SOT65P210X110-3N = smd 1.05 x 0.5: 1 -1.05,0.65; 2 -1.05,-0.65; 3 1.05,0
ERA-1AEB3401C_0201 = smd 0.35 x 0.25: 1 0,0.275; 2 0,-0.275
CPF0201D7K68C1_0201 = smd 0.35 x 0.25: 1 0,0.275; 2 0,-0.275
ESP32_C6_LIBRARY_7_JUMPER_SJ = smd 1.168 x 1.6: 1 -0.762,0; 2 0.762,0
2025-10-22_07-23-44_LIBRARY_SW_EVP-AKE31A_PAN = smd 0.711 x 1.092: 1 -1.4,-0.972; 2 1.4,-0.972 | drill 0.559 pad 0.914 square: 3 -1.848,0.381; 4 1.848,0.381 | smd 1.397 x 1.092: 5 0,-1.124
HECTOR_WATCH_1_TP20R = smd 2 x 2: TP 0,0
NORDIC_NRF_4_AQFN50P700X700X85_HS-74N = smd 4.85 x 4.85: P$74 0,0 | drill 0.3 pad 0.6: P$75 -1.8,1.8; P$76 -0.6,1.8; P$77 0.6,1.8; P$78 1.8,1.8; P$79 -1.8,0.6; P$80 -0.6,0.6; P$81 0.6,0.6; P$82 1.8,0.6; P$83 -1.8,-0.6; P$84 -0.6,-0.6; P$85 0.6,-0.6; P$86 1.8,-0.6; P$87 -1.8,-1.8; P$88 -0.6,-1.8; P$89 0.6,-1.8; P$90 1.8,-1.8 | smd 0.2 x 0.2: P$A8 -1.25,3.25; P$A10 -0.75,3.25; P$A12 -0.25,3.25; P$A14 0.25,3.25; P$A16 0.75,3.25; P$A18 1.25,3.25; P$A20 1.75,3.25; P$A22 2.25,3.25; P$A23 2.75,3.25; P$AA24 3.25,-2.25; P$AB2 -2.75,-2.5; P$AC5 -2,-2.75; P$AC9 -1,-2.75; P$AC11 -0.5,-2.75; P$AC13 0,-2.75; P$AC15 0.5,-2.75; P$AC17 1,-2.75; P$AC19 1.5,-2.75; P$AC21 2,-2.75; P$AC24 3.25,-2.75; P$AD2 -2.75,-3.25; P$AD4 -2.25,-3.25; P$AD6 -1.75,-3.25; P$AD8 -1.25,-3.25; P$AD10 -0.75,-3.25; P$AD12 -0.25,-3.25; P$AD14 0.25,-3.25; P$AD16 0.75,-3.25; P$AD18 1.25,-3.25; P$AD20 1.75,-3.25; P$AD22 2.25,-3.25; P$AD23 2.75,-3.25; P$B1 -3.25,2.75; P$B3 -2.5,2.75; P$B5 -2,2.75; P$B7 -1.5,2.75; P$B9 -1,2.75; P$B11 -0.5,2.75; P$B13 0,2.75; P$B15 0.5,2.75; P$B17 1,2.75; P$B19 1.5,2.75; P$B24 3.25,2.75; P$C1 -3.25,2.25; P$D2 -2.75,2; P$D23 2.75,2; P$E24 3.25,1.75; P$F2 -2.75,1.5; P$F23 2.75,1.5; P$G1 -3.25,1.25; P$H2 -2.75,1; P$H23 2.75,1; P$J1 -3.25,0.75; P$J24 3.25,0.75; P$K2 -2.75,0.5; P$L1 -3.25,0.25; P$L24 3.25,0.25; P$M2 -2.75,0; P$N1 -3.25,-0.25; P$N24 3.25,-0.25; P$P2 -2.75,-0.5; P$P23 2.75,-0.5; P$R1 -3.25,-0.75; P$R24 3.25,-0.75; P$T2 -2.75,-1; P$T23 2.75,-1; P$U1 -3.25,-1.25; P$U24 3.25,-1.25; P$V23 2.75,-1.5; P$W1 -3.25,-1.75; P$W24 3.25,-1.75; P$Y2 -2.75,-2; P$Y23 2.75,-2
ESP32_C6_LIBRARY_SON50P200X200X80-9N = smd 0.76 x 0.27: 1 -0.985,0.75; 2 -0.985,0.25; 3 -0.985,-0.25; 4 -0.985,-0.75; 5 0.985,-0.75; 6 0.985,-0.25; 7 0.985,0.25; 8 0.985,0.75 | smd 0.9 x 1.3: 9 0,0
NORDIC_NRF_BT-XTAL_2016_N = smd 0.95 x 0.85: 1 -0.725,-0.575; 2 0.725,-0.575; 3 0.725,0.575; 4 -0.725,0.575
NORDIC_NRF_1_XTAL_3215_N = smd 1 x 1.8: 1 -1.25,0; 2 1.25,0

### Placement (x,y rotation side)
ANT1  43.36,16.72 0 top
C1  40.38,22.3 0 top
C1-EP-DR  15.42,20.96 0 top
C2  36.26,22.35 90 top
C2-EP-DR  21.17,12.76 180 top
C3  37.15,16.09 270 top
C4  37.94,16.3 270 top
C5  28.77,18.74 90 top
C6  28.06,13.91 180 top
C7  33.24,11.61 270 top
C8  35.64,11.5 270 top
C9  37.23,15.01 0 top
C10  33.4,20.81 0 top
C11  37.09,18.6 270 top
C12  35.81,20.8 90 top
C13  34.35,20.67 90 top
C14  30.05,20.57 90 top
C15  33.22,21.8 0 top
C16  32.25,20.79 0 top
C17  28.09,21.5 0 top
C18  26.94,16.4 0 top
C19  11.18,6.87 270 top
C20  30.83,11.32 270 top
C21  29.32,11.31 270 top
C22  38.8,18.93 0 top
C23  12.99,33.82 180 top
C24  11.68,32.91 180 top
C25  11.7,31.83 0 top
C27  16.97,26.52 270 top
C29  34.13,6.07 270 top
C30  12.61,6.02 270 top
C31  22.87,6.02 270 top
C32  39.23,9.82 0 top
C33  11.68,30.61 0 top
C34  39.33,5.92 0 top
C37  23.75,24.92 180 top
C38  23.71,26.82 180 top
C39  23.72,25.85 0 top
C42  26.39,27.32 90 top
C43  28.11,27.51 0 top
D2  15.95,10.41 180 top
D3  27.19,24.61 0 top
D4  20.73,10.5 0 top
D5  16.89,12.61 0 top
EPD_C1  12.97,21.76 180 top
EPD_C2  13.02,22.96 180 top
EPD_C5  13.05,20.62 0 top
EPD_C6  12.99,19.44 180 top
EPD_C7  12.94,18.24 180 top
EPD_C8  12.94,17.14 180 top
EPD_C9  12.94,15.64 180 top
EPD_C10  13,14.44 180 top
EPD_C11  13.06,13.16 180 top
EPD_C12  12.28,11.83 180 top
IC1  22.05,25.83 0 top
IC2  39.66,8.07 0 top
IC3  10.07,8.55 0 top
IC9  13.95,31.83 0 top
J1  9.1,17.5 270 top
J2  35.98,27.88 0 top
J4  23,33.7 180 top
L1  38.39,17.4 0 top
L2  31.04,20.68 90 top
L3  31.27,22.22 0 top
L5  17.62,16.92 180 top
L7  16.42,31.72 270 top
Q1  39.7,12.96 270 top
Q3  15.52,23.03 0 top
R1_EP_DR  16.64,22.25 270 top
R1_USB  25.23,26.82 270 top
R2  10.07,6.82 0 top
R2_EP_DR  15.85,23.73 270 top
R2_USB  21.41,27.82 90 top
R3  9.47,6.82 180 top
R4  8.23,8.22 270 top
R5  13.99,5.94 180 top
R7  35.35,6.22 180 top
R8  21.61,6.32 180 top
R9  21.21,24.39 180 top
R17  13.59,30.1 90 top
R18  14.29,29.52 90 top
R_PWR_EPD  37.45,13.02 0 top
R_TYPE_SEL  17.92,21.15 180 top
SJ1  20.13,21.64 180 top
SW_DN  34,3 180 top
SW_ENT  23,3 180 top
SW_UP  12,3 180 top
TP_3.3V  8.88,30.78 0 top
TP_3V3  30.6,31.09 0 top
TP_BAT_GND  15.41,27.86 0 top
TP_GND  42.37,28.18 0 top
TP_ON  42.51,6.33 0 top
TP_OP  42.59,9.38 0 top
TP_RESET  40.97,32.98 0 top
TP_SCL  42.32,22.53 0 top
TP_SDA  42.39,25.38 0 top
TP_SWDCLK  38.23,33.58 0 top
TP_SWDIO  35.6,33.58 0 top
TP_SWO  42.36,30.68 0 top
TP_VBAT  15.15,25.38 0 top
TP_VREG  8.91,33.21 0 top
U1  33.1,16.37 0 top
U3  19.19,25.91 0 top
X1  38.25,21.63 180 top
X2  27,19.01 90 top

### Tracks (layer width: path | path; a pad name or v marks a point on that pad's centre or on a via)
3V3  (via drill 0.15 pad 0.3)
  Top 0.15: 39.7,6.8 39.7,6.11 C34.2 40.73,4.7
  Top 0.3: U1.P$B1 30.05,19.32 C14.1 28.87,20.07 v28.8,20 29.36,20.56 29.36,23.17 31.29,25.11 | 26.86,11.84 28.56,13.54 C6.1 29.25,14.6 29.85,14.6 U1.P$W1 30.15,14.32 30.3,14.32 U1.P$Y2 | 26.86,11.84 24.81,9.79 | 24.81,9.79 R8.2 21.46,6.45 21.32,6.45 21.09,6.21 R5.2 14.35,6.57 14.35,7.41 13.89,7.88 11.93,7.88 C19.1 | U1.P$AD14 33.23,13 33.23,11.88 C7.1 | TP_3.3V.TP 11.01,30.78 11.1,30.7 | 11.1,30.7 C33.1 11.6,30.19 11.6,30.14 11.77,29.98 | C25.1 11.2,30.8 11.1,30.7 | 11.77,29.98 12.6,29.98 12.71,30.1 R17.1 13.31,30.25 13.94,30.87 13.94,31.02 IC9.E2 IC9.E3 | 14.02,29.62 R18.1 13.7,29.2 v13.2,29.2 12.38,28.38 11.3,28.38 11.01,28.67 11.01,29.11 11.77,29.87 11.77,29.98 | 39.7,6.8 39.7,7.53 IC2.C2 39.56,7.47 39.56,7.4 38.65,6.49 R7.2 | 40.73,4.7 43.7,4.7 44.8,5.8 44.8,10.4 43.19,12.01 Q1.2 37.97,12.75 R_PWR_EPD.2 37.3,12.89 37.16,12.89 36.93,13.12 U1.P$AD23 35.73,13 35.73,12.74 35.64,12.66 C8.1 34.55,11.75 34.44,11.87 C7.1 | IC3.3 10.39,7.7 10.39,7.48 10.75,7.12 C19.1 | TP_3V3.TP 31.53,30.16 31.53,27.87 32.79,26.61 | C12.1 35.81,20.11 35.47,19.78 35.47,19.74 U1.P$A22 | C12.1 35.66,20.4 | 31.29,25.11 32.79,26.61 | J2.1 34.37,27.24 34.12,27 33.19,27 32.79,26.61 | 31.29,25.11 31.76,25.11 33.1,23.76 34.34,23.76 34.94,23.16 34.94,22.12 v34.93,22.11 | v24.6,10.7 24.81,10.49 24.81,9.79 | IC3.7 10.82,9.54 10.56,9.8 9.58,9.8 9.39,9.62 9.39,9.4 IC3.10 8.57,9.32 7.93,9.97 7.22,9.97 7.03,9.78 6.73,9.78 6.3,9.35 6.3,5.63 6.61,5.32 11.12,5.32 11.9,6.1 11.9,6.64 11.42,7.12 C19.1 | C7.1 32.73,11.87 32,11.14 32,10.1 31.6,9.7 28.27,9.7 26.85,11.12 26.85,11.78 26.86,11.79 26.86,11.84
  Top 0.3: C12.1 35.63,20.37 v35.08,20.37
  Route63 0.3: 22.64,20 22.7,19.94 22.7,12.82 23.41,12.1 23.41,11.88 v24.6,10.7 | 22.64,20 24.71,20 25.14,20.43 25.61,20.43 26.04,20 v28.8,20 | v35.08,20.37 34.93,20.52 v34.93,22.11 | v13.2,29.2 13.97,28.43 14.75,28.43 17.8,25.37 17.8,24.84 22.64,20
ALERT  (via drill 0.15 pad 0.3)
  Top 0.127: v36.88,17.12 36.38,17.12 U1.P$J24 | v32.53,23.16 32.41,23.03 v30.32,23.03 | v20.38,24.62 20.38,25.12 20.25,25.12 U3.5
  Bottom 0.127: v36.88,17.12 34.12,19.88 34.12,20.12 32.53,21.71 v32.53,23.16 | v30.32,23.03 27.88,25.48 27.88,25.62 27.5,26 27.25,26 25.38,24.12 25.38,23.5 25,23.12 21.88,23.12 v20.38,24.62
D+  (via drill 0.15 pad 0.3)
  Top 0.127: D3.4 28.35,23.62 27.88,23.62 25.38,21.12 v25.38,19.88 | U1.P$AD6 31.5,12.97 31.5,12.7 v31.66,12.54
  Bottom 0.127: v31.66,12.54 31.4,12.54 30.32,11.46 29.92,11.46 29.62,11.75 29.62,13.25 29,13.88 29,15.62 25.38,19.25 v25.38,19.88
D-  (via drill 0.15 pad 0.3)
  Top 0.127: v27.25,25.12 27.62,25.5 28.35,25.5 D3.6 | U1.P$AD4 30.88,13.12
  Top 0.3: v30.82,12.62 30.88,12.68 30.88,13.12
  Bottom 0.127: v30.82,12.62 30.82,14.2 30.7,14.32 30.7,22.04 27.53,25.21 27.34,25.21 v27.25,25.12
DEC1
  Top 0.15: C5.1 28.91,18.62 U1.P$C1
DEC3
  Top 0.127: U1.P$D23 35.88,18.38 36.25,18.75 37,18.75 C11.1
DEC4_6  (via drill 0.15 pad 0.3)
  Top 0.127: v33.53,22.66 33.5,22.62 32.91,22.62 | U1.P$E24 36.38,18.12 36.62,18.12 36.75,18 37.73,18 v37.93,18.2 | 32.91,22.62 C15.1 33.14,21.38 C10.1 | 32.91,22.62 31.75,22.62 31.75,22.25 L3.2 31.75,22.12 31.75,21.38 31.99,21.13 C16.1
  Top 0.15: C16.1 31.54,20.34 31.54,19.56 U1.P$B5
  Bottom 0.127: v33.53,22.66 33.88,23 33.88,23.12 34.25,23.5 34.5,23.5 34.88,23.12 34.88,22.95 36.5,21.32 36.5,19.63 v37.93,18.2
DN  (via drill 0.15 pad 0.3)
  Top 0.127: J4.B7 23.75,29.95 23.89,30.09 v23.89,30.12 | J4.A7 22.75,29.88 22.9,30.03 v22.9,30.07 | D3.1 25.88,25.5 25.13,25.5 v24.98,25.35
  Bottom 0.127: v23.9,30.1 22.98,30.1 22.95,30.07 v22.9,30.07 | v23.9,30.1 23.9,26.43 v24.98,25.35 | v23.89,30.12 v23.9,30.1
DP  (via drill 0.15 pad 0.3)
  Top 0.127: J4.A6 23.25,29.75 23.38,29.88 23.38,30.19 23.08,30.49 22.73,30.49 22.49,30.24 22.35,30.1 | 22.35,30.1 22.25,30 J4.B6 | v24.88,23.62 25.85,23.62 D3.3 | 22.35,30.1 22.05,30.1 v22.02,30.13
  Bottom 0.127: v24.88,23.62 23.62,24.88 23.62,28.5 22.02,30.1 v22.02,30.13
EPD_3V3  (via drill 0.15 pad 0.3)
  Top 0.3: Q1.3 40.76,13 v39.8,13 | L5.2 v16.25,16.92 | C1-EP-DR.1 14.79,20.83 13.76,20.83 EPD_C5.2 15.33,18.83 L5.2 | L5.2 14.72,16.31 10.69,16.31 J1.15 J1.16
  Route63 0.3: v16.25,16.92 16.25,9.55 18.5,7.3 34.1,7.3 v39.8,13
EPD_BUSY  (via drill 0.15 pad 0.3)
  Top 0.15: U1.P$AD12 32.85,12.6 31.64,11.39 31.64,10.33 31.39,10.08 31.36,10.05 28.44,10.05 27.2,11.29 27.2,11.63 28.33,12.76 28.71,12.76 v28.74,12.73 | J1.9 8.85,19.25 8.22,18.62 8.22,12.18 9.99,10.41 11.15,10.41 12.47,9.09 22.21,9.09 23.02,9.9 23.14,9.9 23.36,10.12 23.36,11.23 22.81,11.78 22.75,11.78 v22.45,12.08
  Bottom 0.15: v28.74,12.73 28.74,11.75 27.75,10.76 27.49,10.76 26.36,11.89 25.03,11.89 24.15,12.77 24.15,13.23 23.82,13.56 23.01,13.56 22.75,13.3 22.75,12.38 v22.45,12.08
EPD_CS  (via drill 0.15 pad 0.3)
  Top 0.127: U1.P$K2 30.29,16.93 v30.29,17.18
  Top 0.15: v21.05,15.31 21.05,14.97 20.94,14.86 20.94,14.49 19.76,13.31 17.95,13.31 16.89,12.25 16.89,11.38 15.26,9.75 13.03,9.75 11.72,11.06 10.32,11.06 8.98,12.4 8.98,17.88 9.13,18.03 9.65,18.03 9.93,17.75 J1.12
  Bottom 0.15: v30.29,17.18 25.45,22.02 25.45,22.5 25.34,22.61 24.26,22.61 23.84,22.19 23.84,17.28 25.44,15.68 25.44,15.39 25.35,15.3 v21.06,15.3 v21.05,15.31
EPD_DC  (via drill 0.15 pad 0.3)
  Top 0.127: U1.P$AD10 32.27,13.04 32.27,12.52 31.37,11.62 31.37,10.44 31.25,10.32 28.57,10.32 27.64,11.24 v27.64,11.47 | v9.88,18.38 10,18.25 J1.11
  Bottom 0.127: v9.88,18.38 15.55,18.38 19.5,14.43 24.86,14.43 24.92,14.48 25.3,14.48 27.64,12.14 v27.64,11.47
EPD_RST  (via drill 0.15 pad 0.3)
  Top 0.15: J1.10 9.05,18.75 8.5,18.2 8.5,12.3 10.11,10.69 11.27,10.69 12.59,9.37 21.08,9.37 v21.57,9.86 | v24.45,8.45 25.81,9.81 25.81,10.12 26.19,10.5 26.76,10.5 28.02,9.24 31.96,9.24 33.25,10.53 v33.25,10.57 | v32.51,13.6 32.53,13.62 U1.P$AC11
  Bottom 0.127: v32.51,13.6 32.51,10.97 32.91,10.57 v33.25,10.57
  Bottom 0.15: v21.57,9.86 22.98,8.45 v24.45,8.45
GDR  (via drill 0.15 pad 0.3)
  Top 0.127: v9.88,22.75 J1.2 | Q3.1 14.43,23.68 | R2_EP_DR.2 14.48,23.73 14.43,23.68 | 14.43,23.68 14.21,23.9 v13.43,23.9
  Bottom 0.127: v9.88,22.75 11.29,24.16 13.08,24.16 13.08,24.25 v13.43,23.9
GND  (via drill 0.15 pad 0.3)
  Top 0.127: C11.2 37.27,18.52 37.38,18.52 37.5,18.64 38.15,18.64 38.49,18.3 38.9,18.3 39.05,18.45 39.05,18.76 | 39.05,18.76 C22.2 | C4.2 37.73,15.84 C3.2 | C9.2 37.94,15.46 C4.2 | C4.2 38.73,16.05 39.48,16.8 39.48,18.34 39.05,18.76 | C24.1 12.2,32.89 C25.2 12.2,30.63 C33.2
  Top 0.15: C10.2 33.77,20.93 C13.2 34.35,21.38 33.92,21.8 C15.2 | U1.P$F23 35.2,17.87 U1.P$78 | EPD_C2.1 13.52,21.81 EPD_C1.1 13.47,21.54 EPD_C5.1 12.55,20.38 EPD_C6.1 | EPD_C9.1 14.33,15.64 14.58,15.39 14.58,14.62 14.4,14.44 EPD_C10.1 13.56,14.37 | C38.1 C39.2 24.25,25.82 C37.1 | U3.6 19.44,25.66 U3.9 18.79,25.51 18.79,25.46 18.49,25.16 U3.4 | C27.1 16.98,26.7 18.17,26.7 U3.1 | J4.A12_B1 19.25,28.98 J4.SH4 | U1.P$B7 31.6,17.87 U1.P$74 31.9,16.37 U1.P$79 | IC9.B1 IC9.C1 IC9.C2 IC9.C3
  Top 0.3: J2.5 J2.3 36.3,27.11 v35.78,26.59
  other vias: 35.84,23.23 20.21,10.47 14.32,3.98 13.34,7.2 10.6,6 9.88,8.62 8.43,6.88 9.73,15.22 26.76,13.9 25.87,16.37 30.01,21.98 27.08,21.49 16.6,23.69 28.54,10.95 17.25,25.14 22.25,27.83 32.26,20.13 40.87,8.07 33.6,33.6 31.8,33.6 30,33.6 24.6,33.6 22.8,33.6 21,33.6 6.6,33.6 4.8,33.6 39,31.8 21,31.8 19.2,31.8 17.4,31.8 10.2,31.8 6.6,31.8 4.8,31.8 3,31.8 28.2,30 10.2,30 6.6,30 4.8,30 3,30 1.2,30 30,28.2 10.2,28.2 8.4,28.2 6.6,28.2 4.8,28.2 3,28.2 1.2,28.2 40.8,26.4 31.8,26.4 30,26.4 28.2,26.4 26.4,26.4 6.6,26.4 4.8,26.4 3,26.4 1.2,26.4 40.8,24.6 39,24.6 30,24.6 19.2,24.6 12,24.6 40.8,22.8 28.2,22.8 15.6,22.8 42.6,21 40.8,21 22.8,21 17.4,19.2 17.4,15.6 21,13.8 17.4,13.8 15.6,13.8 13.8,13.8 44.4,12 21,12 17.4,12 26.4,8.4 4.8,8.4 3,8.4 1.2,8.4 31.8,6.6 30,6.6 28.2,6.6 26.4,6.6 24.6,6.6 28.2,1.2 26.4,1.2 19.2,1.2 17.4,1.2 15.6,1.2 8.4,1.2 6.6,1.2 4.8,1.2 30,1.2 37.2,1.2 39,1.2 40.8,1.2 3,3 4.8,3 6.6,3 8.4,3 15.6,3 17.4,3 19.2,3 26.4,3 28.2,3 30,3 37.2,3 39,3 40.8,3 42.6,3 1.2,4.8 3,4.8 4.8,4.8 6.6,4.8 8.4,4.8 13.8,4.8 15.6,4.8 17.4,4.8 19.2,4.8 21,4.8 24.6,4.8 26.4,4.8 28.2,4.8 30,4.8 31.8,4.8 35.4,4.8 37.2,4.8 39,4.8 1.2,6.6 3,6.6 4.8,6.6
  pour Route2: 49.1,18.2 40.8,18.2 40.6,18 40.5,18 40.6,17.9 40.6,15.3 40.7,15.2 49,15.2 49,-4.7 48.5,-5.2 -1.9,-5.2 -1.9,39.8 -2.5,40.4 48.5,40.4 49,39.9 49,18.3
  pour Top: -3.6,38.3 49,38.3 49.1,38.4 49.1,18.3 49,18.2 40.9,18.2 40.8,18.3 40.6,18.1 40.6,15.4 40.9,15.1 49.1,15.1 49.2,15.2 49.2,-3.9 49.3,-4 -3.7,-4 -3.9,-4.2 -3.9,38
  pour Bottom: 1.87,38.63 48.16,38.63 49.77,37.02 49.77,18.4 49.56,18.19 40.85,18.19 40.69,18.03 40.69,15.4 40.92,15.17 49.41,15.17 49.6,15.36 49.6,-2.83 48.97,-3.46 -3.03,-3.46 -3.62,-2.87 -3.62,33.12 1.85,38.59 1.85,38.61
HAPTIC_EN  (via drill 0.15 pad 0.3)
  Top 0.15: U1.P$U1 29.75,15.02 29.17,15.02 28.85,14.7 26.49,14.7 26.29,14.5 26.29,12.04 v25.49,11.25 | IC2.A1 27.6,8.57 26.48,9.69 v26.48,10 | v26.48,10
  Bottom 0.15: v26.48,10 26.48,10.27 25.5,11.25 v25.49,11.25
IMU_INT1  (via drill 0.15 pad 0.3)
  Top 0.15: IC3.5 22.6,8.3 24.2,9.9 24.2,11.7 25.02,12.52 v25.18,12.52 | U1.P$N1 28.83,15.1 25.8,15.1 25.3,14.6 25.3,14.38 v25.06,14.14
  Bottom 0.15: v25.06,14.14 25.18,14.02 v25.18,12.52
IMU_INT2  (via drill 0.15 pad 0.3)
  Top 0.15: IC3.6 22.6,8.8 23.8,10 23.8,12.11 v24.73,13.04 | v30.36,15.79 v30.35,15.8 U1.P$P2
  Route63 0.15: v30.36,15.79 29.87,15.3 27,15.3 v24.73,13.04
LX1
  Top 0.15: 14.93,32.23 IC9.B3 IC9.B2
  Top 0.3: 14.93,32.23 15.9,32.23 L7.1
LX2
  Top 0.127: 14.97,31.43 15,31.38 15.62,30.75 16.38,30.75 L7.2
  Top 0.15: IC9.D2 IC9.D3 14.9,31.43 14.97,31.43
MOSI  (via drill 0.15 pad 0.3)
  Top 0.15: U1.P$B13 v33.1,19.11 | v9.66,16.7 9.71,16.75 J1.14
  Route63 0.15: v33.1,19.11 U1.P$B13 32.88,19.34 25.39,19.34 23.87,17.82 23.87,13.11 23.98,13 23.98,12.09 25.08,10.99 25.08,10.5 24.8,10.22 23.55,10.22 21.97,11.8 21.97,17.18 21.38,17.77 15.65,17.77 14.49,16.61 11.5,16.61 11.41,16.7 v9.66,16.7
N$1  (via drill 0.15 pad 0.3)
  Top 0.127: 38.5,16.62 38,16.62 C4.1 | 38.5,16.62 38.95,17.08 L1.2 | v38.17,19.66 38.17,19.3 C22.1 | 38.5,16.62 v38.62,16.62 | v43.17,19.55 43.14,19.27 ANT1.1 | v39.62,19 40.12,19.5 41.95,19.5 v42,19.45
  Bottom 0.127: 38.84,19 v38.17,19.66 | v38.62,16.62 38.62,18.75 38.38,19 38.84,19 | 38.84,19 v39.62,19
  Bottom 0.15: v42,19.45 42.09,19.55 v43.17,19.55
N$2  (via drill 0.15 pad 0.3)
  Top 0.127: v7.84,8.8 8,8.64 8,8.38 8.12,8.25 8,8.12 R4.2 | IC9.D1 13.45,31.53 13.43,31.53 13.39,31.56 v12.98,31.56
  Bottom 0.127: v7.84,8.8 7.84,25.59 8.25,26 8.25,26.83 v12.98,31.56
N$3
  Top 0.15: R9.2 21.77,25.23 IC1.D1
N$4
  Top 0.127: U1.P$A23 35.88,19.62 37.43,21.18 X1.3 37.12,21.05 C2.1
N$5  (via drill 0.15 pad 0.3)
  Top 0.127: v13.03,30.73 13.05,30.73 IC9.E1 | v9.5,6 9.88,6.38 9.88,6.5 10,6.5 R2.2
  Bottom 0.127: v13.03,30.73 13.03,29.68 8.9,25.55 8.9,6.6 v9.5,6
N$6  (via drill 0.15 pad 0.3)
  Top 0.127: v24.75,30.2 24.25,29.7 J4.A5 | R1_USB.2 25,26.75 25,26.5 25.07,26.43 v25.07,26.27
  Bottom 0.127: v24.75,30.2 24.75,26.75 25.07,26.43 v25.07,26.27
N$7
  Top 0.127: L3.1 30.88,22.12 30.88,21.12 30.95,21.12 L2.2
N$8
  Top 0.127: IC3.1 9.38,7.75 9.38,7.62 9.5,7.5 9.5,7.12 R3.2
N$9
  Top 0.127: U1.P$B24 36.38,19.12 36.38,19.75 36.5,19.75 36.88,20.12 37.85,20.12 38.28,20.55 38.28,21.53 38.42,21.67 38.44,21.67 X1.1 38.98,22.25 40.06,22.25 C1.1
N$10
  Top 0.127: 37.5,17.62 37.84,17.62 L1.1 | 37.5,17.62 36.38,17.62 36.12,17.38 35.88,17.38 U1.P$H23 | 37.5,17.62 37.5,17 37.17,16.67 C3.1
N$11
  Top 0.127: IC2.A2 39.75,8.62 39.75,9.75 C32.2
N$13
  Top 0.127: 21.77,11.66 21.77,12.66 C2-EP-DR.1 | D2.1 17.75,10.5 18.21,10.96 18.21,10.98 18.89,11.66 21.77,11.66 | 21.77,11.66 21.77,11.21 D4.2
N$14
  Top 0.127: C9.1 37,15.05 37,15.36 36.74,15.62 36.74,15.73 U1.P$N24
N$15
  Top 0.127: 18.02,21.53 18.27,21.78 19.14,21.78 19.27,21.66 SJ1.2 | 18.02,21.53 17.27,22.28 17.02,22.28 R1_EP_DR.1 | 18.02,21.53 R_TYPE_SEL.2
N$16  (via drill 0.15 pad 0.3)
  Top 0.127: C2-EP-DR.2 20.64,12.66 v19.64,12.66 18.64,12.66 D5.2 | v17.57,19.91 19.83,17.65 L5.1 19.45,16.47 18.78,15.66 v18.78,13.79 | v17.89,22.41 17.27,23.03 Q3.3
  Bottom 0.127: v17.89,22.41 17.57,22.08 v17.57,19.91 | v19.64,12.66 18.78,12.66 v18.78,13.79
N$17  (via drill 0.15 pad 0.3)
  Top 0.127: v9.88,21.75 J1.4 | v10.75,24.5 12.29,22.96 EPD_C2.2
  Bottom 0.127: v9.88,21.75 9.38,22.25 9.38,23.12 v10.75,24.5
N$18
  Top 0.127: J1.5 10.75,21.38 11.12,21.38 11.28,21.53 12.27,21.53 12.39,21.66 EPD_C1.2
N$20  (via drill 0.15 pad 0.3)
  Top 0.127: v30.12,11.88 30.75,11.88 C20.1 | v30,13.5 30.5,13.5 30.62,13.62 31.12,13.62 U1.P$AC5
  Bottom 0.127: v30.12,11.88 30,12 v30,13.5
N$22
  Top 0.127: U1.P$B3 30.62,19.12 30.62,20 30.66,20 L2.1
N$26
  Top 0.127: J4.B5 21.25,27.88 R2_USB.1
N$30  (via drill 0.15 pad 0.3)
  Top 0.15: J1.18 10.32,14.75 v9.59,14.02 | v11.6,19.37 11.67,19.44 EPD_C6.2
  Bottom 0.15: v9.59,14.02 9.3,14.31 9.3,19.07 10.34,20.11 11.45,20.11 11.6,19.96 v11.6,19.37
N$31  (via drill 0.15 pad 0.3)
  Top 0.127: 12.52,18.28 EPD_C7.2 12.08,18.24 v11.66,17.82 | J1.19 11.12,14.25 11.24,14.37 11.24,14.97 v11.65,15.38
  Bottom 0.127: v11.65,15.38 11.65,16.33 11.19,16.79 11.19,17.35 v11.66,17.82
N$32  (via drill 0.15 pad 0.3)
  Top 0.127: EPD_C8.2 12.39,17.09 v11.7,17.09 | J1.20 11.44,13.75 11.71,14.02 v11.71,14.7
  Bottom 0.127: v11.7,17.09 11.7,16.64 12,16.34 12,15.25 11.71,14.96 v11.71,14.7
N$34
  Top 0.127: J1.22 10.75,12.88 11.12,12.88 12.02,13.77 12.02,13.65 12.39,14.03 12.39,14.4 EPD_C10.2
N$35
  Top 0.127: C13.1 U1.P$A18
N$37
  Top 0.127: J1.24 11.78,11.75 EPD_C12.2
OUT+
  Top 0.127: IC2.A3 40.25,8.62 40.38,8.75 41.38,8.75 42,9.38 42.5,9.38 TP_OP.TP
OUT-
  Top 0.127: IC2.C3 40.25,7.5 40.88,6.88 41.38,6.88 41.88,6.38 42.5,6.38 TP_ON.TP
P0.00/XL1
  Top 0.127: 28.02,17.88 27,17.88 X2.1 | 28.02,17.88 28.12,17.88 28.3,18.05 | C17.2 28.16,21.32 28.16,21.21 28.09,21.13 28.09,19.68 28.02,19.62 28.02,17.88
  Top 0.15: U1.P$D2 30.16,18.18 29.62,18.18 29.34,17.9 28.45,17.9 28.3,18.05
P0.01/XL2
  Top 0.127: 28.2,17 26,17 25.88,17.12 25.88,20.25 X2.2 | 28.2,17 28.8,17 29,16.8 29,16.5 28.9,16.4 C18.2 | 28.2,17 28.84,17.64 29.45,17.64 29.73,17.91 29.97,17.91 30.01,17.87 U1.P$F2
P0.13  (via drill 0.15 pad 0.3)
  Top 0.127: R5.1 13.95,5.62 12.62,5.62 C30.2 12.5,5.5 12.01,5.5 v11.71,5.2 | v11.38,3.12 10.62,3.88 SW_UP.2
  Bottom 0.127: v11.71,5.2 11.38,4.87 v11.38,3.12
P0.14  (via drill 0.15 pad 0.3)
  Top 0.127: 22.12,6 21.62,6 R8.1 | 22.12,6 22.75,5.38 22.88,5.5 C31.2 | v22.25,6 22.12,6 | v22.25,3.12 21.5,3.88 SW_ENT.2
  Bottom 0.127: v22.25,3.12 v22.25,6
P1.01  (via drill 0.15 pad 0.3)
  Top 0.127: R_PWR_EPD.1 37.91,13.75 38.54,13.75 Q1.1 38.7,14.28 39.08,14.66 39.08,15.36 v38.76,15.68 | U1.P$Y23 v35.91,14.37
  Bottom 0.15: v38.76,15.68 38.06,14.98 36.52,14.98 v35.91,14.37
P1.02  (via drill 0.15 pad 0.3)
  Top 0.127: 34.88,5.62 34.38,5.62 34.25,5.75 34.12,5.62 C29.2 | 34.88,5.62 35,5.62 35.25,5.88 R7.1 | v36.75,14.38 36.62,14.38 36.38,14.62 U1.P$W24 | v33.38,3.12 32.62,3.88 SW_DN.2 | 34.88,5.62 v34.88,5.5
  Bottom 0.127: v36.75,14.38 36.38,14 36.38,13.66 35.67,12.96 34.82,12.96 34.56,12.7 34.56,12.33 34.79,12.1 34.79,10.17 33.38,8.75 33.38,5.5 | v33.38,3.12 33.38,5.5 | 33.38,5.5 v34.88,5.5
PMIC_INT  (via drill 0.15 pad 0.3)
  Top 0.127: IC1.A1 21.57,26.43 20.97,27.03 20.75,27.03 19.88,27.9 17.18,27.9 16.84,28.24 16.84,28.43 16.22,29.05 14.92,29.05 14.22,28.35 14.22,28.31 14.09,28.18 | 14.09,28.21 14.09,28.18 | 14.09,28.18 14.09,26.69 13.5,26.1 13.5,25 14.31,24.19 15.64,24.19 15.85,24.4 16.54,24.4 18.04,22.9 24.4,22.9 24.7,22.6 v24.7,22.2
  Top 0.15: U1.P$T2 30.35,14.95 v30.3,14.9
  Bottom 0.15: v24.7,22.2 24.7,21.39 28.4,17.69 28.4,16.8 v30.3,14.9
PREVGH  (via drill 0.15 pad 0.3)
  Top 0.127: v9.88,13.25 J1.21 | v14.14,12.53 14.27,12.66 15.02,12.66 D5.1 | v14.14,15.03 13.02,15.03 12.52,15.53 EPD_C9.2
  Bottom 0.127: v9.88,13.25 10.6,12.53 v14.14,12.53 v14.14,15.03
PREVGL  (via drill 0.15 pad 0.3)
  Top 0.127: EPD_C11.2 12.52,13.16 12.52,12.91 11.99,12.38 10.75,12.38 J1.23 10,12.25 v9.88,12.12 | v14,11.25 14.12,11.25 14.12,10.5 D2.2
  Bottom 0.127: v14,11.25 13.12,12.12 v9.88,12.12
RESE  (via drill 0.15 pad 0.3)
  Top 0.127: R1_EP_DR.2 16.27,22.28 16.14,22.28 16.02,22.41 15.38,22.41 15.27,22.52 | J1.3 9.75,22.25 9.38,21.88 9.38,21.1 v9.55,20.93 | v14.51,23.02 14.77,23.02 15.27,22.52 | Q3.2 14.61,22.52 15.27,22.52
  Bottom 0.127: v14.51,23.02 14.51,21.53 13.9,20.93 v9.55,20.93
RESET  (via drill 0.15 pad 0.3)
  Top 0.127: v39.75,33.62 40.12,33.25 40.12,33 40.88,33 TP_RESET.TP | J2.6 37.52,28.4 37.5,28.38 37.39,28.38 v36.92,27.91
  Top 0.15: U1.P$AC13 v33.22,13.62 | TP_RESET.TP 42.07,31.88 42.86,31.88 45.3,29.44 45.3,18.7 44,18.7 v43.7,19 | v42.2,18.8 40.1,18.8 39.9,18.6 39.9,16.3 39.4,15.8 39.4,13.3 39,12.9 v38.7,12.9 | v37.4,11.8 37.4,11.3 36.8,10.7 35,10.7 34.31,11.39 v34.17,11.39
  Bottom 0.127: v39.75,33.62 39.5,33.38 39.5,30.88 38,29.38 38,29.12 36.92,28.05 v36.92,27.91
  Bottom 0.15: v42.2,18.8 42.4,19 v43.7,19 | v33.22,13.62 34.17,12.67 v34.17,11.39 | v37.4,11.8 38.5,12.9 v38.7,12.9
SCK  (via drill 0.15 pad 0.3)
  Top 0.127: U1.P$A12 32.85,20.02 v32.96,20.13
  Top 0.15: J1.13 9.93,17.25 v9.78,17.4
  Route63 0.15: 32.46,18.99 25.56,18.99 24.15,17.58 24.15,13.22 24.25,13.12 24.25,12.77 24.99,12.03 25.4,12.03 26.01,11.42 26.01,11.04 24.91,9.94 23.43,9.94 21.69,11.68 21.69,16.91 21.13,17.47 15.9,17.47 15.37,16.94 15.37,16.63 14.96,16.22 9.15,16.22 9.15,16.87 9.68,17.4 v9.78,17.4 | 32.46,18.99 32.54,18.99 | v32.96,20.13 33.5,20.13 33.87,19.76 33.87,19.2 33.3,18.62 32.9,18.62 32.75,18.78 32.67,18.78 32.46,18.99
SCL  (via drill 0.15 pad 0.3)
  Top 0.127: 21,26.25 20.88,26.25 20.75,26.12 20.25,26.12 U3.7 | 21,26.25 21.25,26.25 21.38,26.12 21.82,26.12 IC1.B1 | v14.75,30.12 14.09,30.12 R17.2 13.87,30.05 13.41,29.59 12.21,29.59 v11.92,29.3 | v38.62,7.62 39.12,7.62 IC2.C1 | v41.88,21.25 41.88,21.5 42,21.62 42,22.5 42.25,22.5 TP_SCL.TP | IC3.12 9.25,8.25 8.62,8.25 R4.1 8.53,8.24 v8.53,8.85 | 21,26.25 21,26.42 v21.04,26.46 | v34.38,10.38 35.47,10.38 v35.62,10.22 | v28.25,15.88 28.12,15.75 v24.63,15.75
  Top 0.15: v30.33,16.48 30.35,16.46 U1.P$M2
  Route63 0.15: v28.25,15.88 29.58,15.88 30.18,16.48 v30.33,16.48
  Bottom 0.127: v14.75,30.12 15.25,30.12 19.88,25.5 | v41.88,21.25 41.67,21.25 40.6,20.18 40.6,9.6 v38.62,7.62 38.5,7.75 38.5,9.25 38.62,9.38 38.62,9.62 38.03,10.22 v35.62,10.22 | v34.38,10.38 34.38,10.13 34.22,9.98 31.02,9.98 29.25,11.75 29.25,13.25 28.25,14.25 v28.25,15.88 | v21.04,26.46 21.09,26.46 21.54,26.01 21.54,25.54 21.21,25.21 20.17,25.21 19.88,25.5 | v8.53,8.85 8.53,25.91 v11.92,29.3 | v24.63,15.75 19.88,20.5 19.88,25.5
SDA  (via drill 0.15 pad 0.3, 0.35)
  Top 0.127: IC3.2 9.88,7.75 9.88,7.5 10.25,7.12 10.12,7 R2.1 10.3,6.86 10.32,6.86 10.43,6.75 10.43,6.34 9.75,5.66 9.04,5.66 7.4,7.3 v7.4,9.54 | v16.48,29.62 16.35,29.5 14.62,29.5 R18.2 | U3.8 20.12,26.62 20.12,26.94 v19.53,27.53 | v41.88,24.12 41.88,24.25 42.12,24.5 42.12,25.12 42.38,25.38 TP_SDA.TP | IC1.C1 21.76,25.63 21.73,25.66 21.71,25.66 21.7,25.67 21.61,25.66 21.08,25.66 v21.04,25.62
  Top 0.15: v7.4,26.3 11.43,26.3 14.62,29.5 | U1.P$L1 28.63,15.4 25.2,15.4 24.66,14.86 v24.64,14.86 | v39.7,8.1 v39.69,8.1 IC2.B2 | v32.6,8 32.8,8.2 v34,8.2 | v23.5,12.8 23.39,12.91 v23.39,14.77
  Bottom 0.127: 20.62,26.25 20.93,25.95 20.93,25.73 v21.04,25.62 | v41.88,24.12 41.62,24.38 41.62,26.75 40.62,27.75 40.62,33.75 39.88,34.5 37.12,34.5 37,34.62 36.75,34.62 35.25,33.12 33.75,33.12 32.5,31.88 23.18,31.88 20.62,29.31 20.62,26.28 20.62,26.25 | v16.48,29.62 18.13,27.97 18.13,27.75 18.38,27.51 19.37,27.51 19.69,27.19 20.62,26.25 | 20.01,27.51 20.01,27.6 19.6,27.6 v19.53,27.53
  Bottom 0.15: 7.4,10.1 v7.4,26.3 | v39.7,8.1 38.6,7 35.1,7 34,8.1 v34,8.2 | v32.6,8 27.9,8 24.85,11.05 24.74,11.05 24.57,11.22 24.57,11.53 24.1,12 | 7.4,10.1 6.3,10.1 5.3,9.1 5.3,4.6 5.9,4 9.1,4 11.6,6.5 18.83,6.5 19.94,7.61 19.94,9.73 20.95,9.73 21.43,10.21 22.54,10.21 24.1,11.77 24.1,12 | 20.01,27.51 19.69,27.19 | v7.4,9.54 7.4,10.1 | v24.64,14.86 24.54,14.77 v23.39,14.77 | v23.5,12.8 23.5,12.6 24.1,12
SWDCLK  (via drill 0.15 pad 0.3)
  Top 0.127: v35.75,13.62 35.88,13.62 36.38,14.12 U1.P$AA24 | v35.75,28 36.25,28.5 36.29,28.5 J2.4 | v37,33 37.12,33.12 37.75,33.12 38.12,33.5 TP_SWDCLK.TP
  Bottom 0.127: v35.75,13.62 35.72,13.62 35.52,13.82 35.52,15.14 37.55,17.17 37.55,18.02 37.63,18.02 37.79,17.86 38.07,17.86 38.27,18.06 38.27,18.35 37.55,19.07 37.55,22.58 35.4,24.73 35.4,27.57 | v35.75,28 35.75,27.92 35.4,27.57 | v37,33 35.4,31.4 35.4,27.57
SWDIO  (via drill 0.15 pad 0.3)
  Top 0.127: U1.P$AC24 36.38,13.62 36.62,13.88 37.52,13.88 v38.52,14.87 | TP_SWDIO.TP 35.5,33.5 35.5,33 v34.88,32.38 35.38,31.88 35.38,29.75 35.12,29.5 35.12,29.01 J2.2
  Bottom 0.127: v34.88,32.38 36.62,34.12 39.88,34.12 40.25,33.75 40.25,16.6 v38.52,14.87
SWO  (via drill 0.15 pad 0.3)
  Top 0.15: U1.P$AD22 35.35,12.87 v35,12.52 | TP_SWO.TP 42.3,30.68 44.7,28.28 v44.7,19.3 | v40.1,15.8 40.3,16 40.3,18.2 40.51,18.41 v41.4,18.41
  Bottom 0.127: 39.55,15.25 v40.1,15.8
  Bottom 0.15: v35,12.52 36.81,12.52 39.55,15.25 | v44.7,19.3 43.8,18.4 v41.41,18.4 v41.4,18.41
VBAT
  Top 0.15: 17.64,26.34 C27.2 16.43,25.8 | IC1.C2 22.4,25.63 22.43,25.6
  Top 0.3: 17.64,26.34 17.82,26.16 U3.2 U3.3 | 16.43,25.8 16.02,25.38 TP_VBAT.TP 16.04,25.38 18.07,23.35 22.34,23.35 22.76,23.77 22.76,24.43 C37.2 23.11,24.92 22.43,25.6
VBUS  (via drill 0.15 pad 0.3)
  Top 0.15: 27,27.5 C42.2 25.8,27.51 | 21.6,26.91 21.77,26.73 21.98,26.73 22.15,26.55 22.15,26.53 IC1.A2
  Top 0.3: 21.6,26.91 21.6,27 | 23.21,27.39 C38.2 | 23.21,27.39 23.62,27.8 24.4,27.8 | 24.4,27.8 24.9,27.8 25.4,28.3 J4.A4_B9 | 27,27.5 C43.1 28.03,27.93 28.03,27.98 28.2,28.14 29.02,28.14 29.06,28.1 29.3,28.1 29.4,28 29.4,25.1 28.91,24.61 D3.5 28.07,24.24 27.62,24.24 27.46,24.07 27.46,23.73 24.1,20.37 24.1,14.4 25.8,12.7 25.81,12.7 v25.93,12.59 | 25.8,27.51 24.7,27.51 24.4,27.8 | U1.P$AD2 29.32,12.09 C21.1 28.5,11.81 v28.28,12.03 | 21.6,27 21.23,27.37 20.89,27.37 20.6,27.66 J4.A9_B4 | 21.6,27 21.99,27.39 23.21,27.39
  Route63 0.3: v25.93,12.59 27.31,12.59 28.07,11.82 v28.28,12.03
VREG  (via drill 0.15 pad 0.3)
  Top 0.15: 22.7,26.03 IC1.B2
  Top 0.3: TP_VREG.TP 10.88,33.21 C24.2 11.6,33.33 11.6,33.38 12.32,34.09 C23.2 13.14,34.25 13.28,34.25 13.55,33.98 13.55,33 13.56,33 | C39.1 23.04,26.03 22.7,26.03 22.63,26.1 22.63,26.59 22.49,26.72 v22.49,26.91 | v14.27,33.7 13.56,33 | 13.56,33 13.55,32.99 IC9.A1 IC9.A2 IC9.A3
  Route63 0.3: v14.27,33.7 17.25,30.71 17.25,27.74 18.02,26.98 19.81,26.98 19.92,27.09 21.51,27.09 21.7,26.9 22.27,26.9 22.27,26.91 v22.49,26.91